# Altium project DRC.PrjPcb (part 1 of 2)
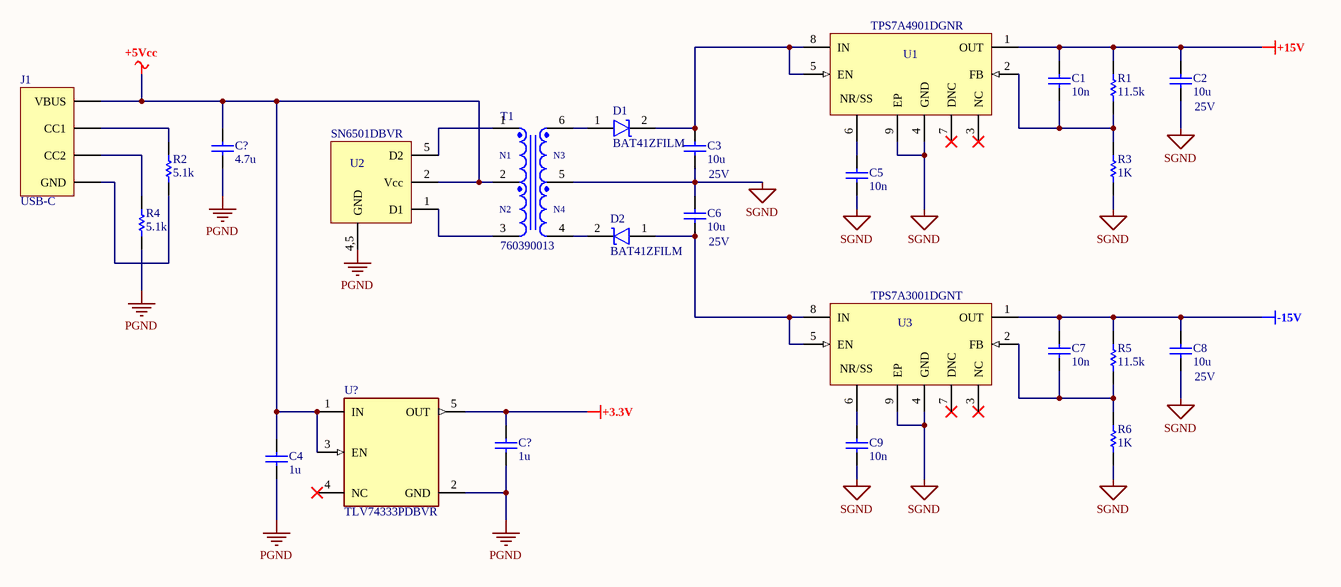
[diagram p0: Power Supply.SchDoc]
15 sheets, 225 parts. Net scope: flat (ports and power ports of the same name join across sheets).
Board file: PCB.PcbDoc
Sheets:
  Power Supply.SchDoc
  MCU.SchDoc
  Balanced Line Receiver.SchDoc
  Precision FBR & dB Converter.SchDoc
  Offset Compensator.SchDoc
  Knee Comp Clipper.SchDoc
  Comp Clipper.SchDoc
  Log and Anti-Log.SchDoc
  Level Detector.SchDoc
  Gain Control.SchDoc
  VCA.SchDoc
  Misc. Connections.SchDoc
  tanh function cell.SchDoc
  Log and Anti-Log Converters 1.SchDoc
  Log and Anti-Log Converters 2.SchDoc

## Sheet Power Supply.SchDoc
size Letter; SheetNumber: 1; SheetTotal: 15; SPICEModelCacheXQHQXUBJ: <root> / <DocumentId>XQHQXUBJ</DocumentId> / </root>

### Parts
(Parts that share a designator on the sheet are numbered #1, #2 ... from top to bottom, then left to right.)
C1  value 10n  (hidden comment: Capacitor)
C2  25V  value 10u
C3  25V  value 10u
C4  value 1u  (hidden comment: Capacitor)
C5  value 10n  (hidden comment: Capacitor)
C6  25V  value 10u
C7  value 10n  (hidden comment: Capacitor)
C8  25V  value 10u
C9  value 10n  (hidden comment: Capacitor)
C?#1  value 4.7u  (hidden comment: Capacitor)
C?#2  value 1u  (hidden comment: Capacitor)
D1  BAT41ZFILM
D2  BAT41ZFILM
J1  USB-C  [FP-USB4125-GF-A-0190-MFG]
R1  value 11.5k  (hidden comment: Resistor)
R2  value 5.1k  (hidden comment: Resistor)
R3  value 1K  (hidden comment: Resistor)
R4  value 5.1k  (hidden comment: Resistor)
R5  value 11.5k  (hidden comment: Resistor)
R6  value 1K  (hidden comment: Resistor)
T1  760390013  [WE-PPTI_1006_L10.2W6.73H4.19]
U1  TPS7A4901DGNR  [DGN0008D_M]
U2  SN6501DBVR
U3  TPS7A3001DGNT  [DGN0008D_M]
U?  TLV74333PDBVR  [FP-DBV0005A-MFG]

### Nets
+3.3V: C?#2.2 U?.5(OUT)
+5Vcc: C4.2 C?#1.2 J1.1(VBUS) T1.2 U2.2(Vcc) U?.1(IN) U?.3(EN)
+15V: C1.2 C2.2 R1.2 U1.1(OUT)
-15V: C7.2 C8.2 R5.2 U3.1(OUT)
PGND: C4.1 C?#1.1 C?#2.1 R4.1 U2.4,5(GND) U?.2(GND)
SGND: C2.1 C3.1 C5.1 C6.2 C8.1 C9.1 R3.1 R6.1 T1.5 U1.4(GND) U1.9(EP) U3.4(GND) U3.9(EP)
NetC1_1: C1.1 R1.1 R3.2 U1.2(FB)
NetC3_2: C3.2 D1.2(K) U1.5(EN) U1.8(IN)
NetC5_2: C5.2 U1.6(NR/SS)
NetC6_1: C6.1 D2.1(A) U3.5(EN) U3.8(IN)
NetC7_1: C7.1 R5.1 R6.2 U3.2(FB)
NetC9_2: C9.2 U3.6(NR/SS)
NetD1_1: D1.1(A) T1.6
NetD2_2: D2.2(K) T1.4
NetJ1_2: J1.2(CC1) R2.2
NetJ1_3: J1.3(CC2) R4.2
NetJ1_4: J1.4(GND) R2.1
NetT1_1: T1.1 U2.5(D2)
NetT1_3: T1.3 U2.1(D1)

Not connected (* = marked no-connect by the designer): U1 3(NC)* 7(DNC)*; U3 3(NC)* 7(DNC)*; U? 4(NC)*

### Notes on the sheet
- (in symbol WE-PPTI_1006) N1; N3; N2; N4

### Library data of the parts
C1-C9 C?#1 C?#2 = Capacitor: SimulationGenericComponent: True
D1 D2 = BAT41ZFILM: Rectifier Diode, Schottky, 1 Phase, 1 Element, 0.2A, 100V V(RRM), Silicon; Manufacturer: STMicroelectronics; Package Body Material: Plastic; Forward Voltage: 450mV; Non-rep Pk Forward Current-Max: 1A; Number of Elements: 1; Max Output current: 200mA; Time @ Peak Reflow Temperature-Max (s): 30s; Qualification Status: Not Qualified; Supplier: Mouser; Supplier Part Number: 511-BAT41ZFILM; Manufacturer Part Number: BAT41ZFILM; RoHS: Yes; Category: Rectifier Diodes; Stock: 43204; Pricing: 1=0.33, 10=0.232, 50=0.232, 100=0.117, 1000=0.071, 10000=0.049 (USD); Pins: 2; Diode Element Material: SILICON; Package Shape: Rectangular; Terminal Finish: Tin; Max Operating Temperature: 150°C; JESD-609 Code: e3; Diode Type: RECTIFIER; JESD-30 Code: R-PDSO-G2; Moisture Sensitivity Level: 1; Package Style: SMALL OUTLINEMeter; Peak Reflow Temperature (Cel): 260°C; Rep Pk Reverse Voltage-Max: 100V; Surface Mount: Yes; Technology: SCHOTTKY; Terminal Form: Gull Wing; Terminal Position: DUAL; Reach SVHC Compliant: Yes; RoHS Compliant: Yes; ComponentLink1URL: https://datasheet.ciiva.com:443/pdfs/VipMasterIC/IC/SGST/SGSTS35734/SGSTS35734-1.pdf?src-supplier=IHS+Markit; ComponentLink1Description: https://datasheet.ciiva.com:443/pdfs/VipMasterIC/IC/SGST/SGSTS35734/SGSTS35734-1.pdf?src-supplier=IHS+Markit; ComponentLink2URL: https://datasheet.ciiva.com/1242/cd00130227-1242625.pdf?src-supplier=Newark; ComponentLink2Description: https://datasheet.ciiva.com/1242/cd00130227-1242625.pdf?src-supplier=Newark; ComponentLink3URL: https://datasheet.ciiva.com/46385/1689714-46385901.pdf?src-supplier=Element14; ComponentLink3Description: https://datasheet.ciiva.com/46385/1689714-46385901.pdf?src-supplier=Element14; ComponentLink4URL: https://datasheet.ciiva.com/46385/1689714-46385899.pdf?src-supplier=Element14; ComponentLink4Description: https://datasheet.ciiva.com/46385/1689714-46385899.pdf?src-supplier=Element14; ComponentLink5URL: https://datasheet.ciiva.com/16421/cd00130227-16421670.pdf?src-supplier=Future+Electronics; ComponentLink5Description: https://datasheet.ciiva.com/16421/cd00130227-16421670.pdf?src-supplier=Future+Electronics; ComponentLink6URL: https://datasheet.ciiva.com/22733/1689714-22733175.pdf?src-supplier=Element14; ComponentLink6Description: https://datasheet.ciiva.com/22733/1689714-22733175.pdf?src-supplier=Element14; ComponentLink7URL: https://datasheet.ciiva.com/915/cd00130227-915684.pdf?src-supplier=Digikey; ComponentLink7Description: https://datasheet.ciiva.com/915/cd00130227-915684.pdf?src-supplier=Digikey; ComponentLink8URL: https://datasheet.ciiva.com/915/cd00130227-915683.pdf?src-supplier=Digikey; ComponentLink8Description: https://datasheet.ciiva.com/915/cd00130227-915683.pdf?src-supplier=Digikey; ComponentLink9URL: https://datasheet.ciiva.com/915/cd00130227-915685.pdf?src-supplier=Digikey; ComponentLink9Description: https://datasheet.ciiva.com/915/cd00130227-915685.pdf?src-supplier=Digikey; ComponentLink10URL: https://datasheet.ciiva.com/15192/getdatasheetpartid-141692-15192973.pdf?src-supplier=Verical; ComponentLink10Description: https://datasheet.ciiva.com/15192/getdatasheetpartid-141692-15192973.pdf?src-supplier=Verical
J1 = USB-C: Generic USB-C Connector, Female
R1-R6 = Resistor: TC1: 0; SimulationGenericComponent: True; TC2: 0
T1 = WE-PPTI_1006: TRANSFORMER 475UH SMD; NexarPartId: 26029731; Turns Ratio: 1:1.7; Current Rating: 150mA; Frequency: 10kHz; DC Resistance (DCR): 470mΩ; Inductance: 475µH; Isolation Voltage: 2.5kV; Termination: SMD/SMT; RoHS: Compliant; Mount: Surface Mount; Length: 10.05mm; Packaging: Digi-Reel®; Height: 4.19mm; Max DC Current: 150mA; Min Operating Temperature: -40°C; Case/Package: SMD/SMT; Max Operating Temperature: 125°C; Height - Seated (Max): 4.19mm; Width: 6.73mm
U1 = TPS7A4901DGNR: Adjustable Positive LDO Regulator, 1.176V Min, 33V Max, 0.6V Dropout, BIPolar, PDSO8; Manufacturer: Texas Instruments; Package Body Material: Plastic; Regulator Type: ADJUSTABLE POSITIVE SINGLE OUTPUT LDO REGULATOR; Dropout Voltage1-Max: 600mV; Dropout Voltage1-Nom: 333mV; Channels: 1; Output Current1-Max: 150mA; Output Voltage1-Min: 1.194V; Package Equivalence Code: TSSOP8,.19; Qualification Status: Not Qualified; Supplier: Mouser; Supplier Part Number: 595-TPS7A4901DGNR; Manufacturer Part Number: TPS7A4901DGNR; RoHS: Yes; Category: Voltage Regulators - Linear; Stock: 5747; Pricing: 1=2.84, 10=2.56, 50=2.56, 100=2.09, 1000=1.5, 10000=1.37 (USD); Case/Package: HTSSOP; Pins: 8; Terminal Finish: Nickel; Package Shape: Square; JESD-609 Code: e4; Moisture Sensitivity Level: 2; Adjustability: ADJUSTABLE; JESD-30 Code: S-PDSO-G8; Number of Outputs: 1; Operating Temperature, TJ-Max: 125°C; Operating Temperature, TJ-Min: -40°C; Output Voltage1-Max: 33V; Package Style: SMALL OUTLINE, HEAT SINK/SLUG, THIN PROFILE, SHRINK PITCHMeter; Packaging: Tape and Reel; Peak Reflow Temperature (Cel): 260°C; Surface Mount: Yes; Technology: BIPOLAR; Terminal Form: Gull Wing; Terminal Position: DUAL; Length: 3mm; Width: 3mm; Height - Seated (Max): 1.1mm; Terminal Pitch: 0.65mm; Reach SVHC Compliant: Yes; RoHS Compliant: Yes; ComponentLink1URL: https://www.ti.com:443/lit/ds/symlink/tps7a49.pdf?src-supplier=IHS+Markit; ComponentLink1Description: https://www.ti.com:443/lit/ds/symlink/tps7a49.pdf?src-supplier=IHS+Markit; ComponentLink2URL: https://datasheet.ciiva.com/4885/sbvs121b-126024-4885345.pdf?src-supplier=Mouser; ComponentLink2Description: https://datasheet.ciiva.com/4885/sbvs121b-126024-4885345.pdf?src-supplier=Mouser; ComponentLink3URL: https://datasheet.ciiva.com/41462/001015155-da-01-en-ic-reg-ldo-adj-tps7a4901dgnr-vssop-8-tid-41462999.pdf?src-supplier=Conrad; ComponentLink3Description: https://datasheet.ciiva.com/41462/001015155-da-01-en-ic-reg-ldo-adj-tps7a4901dgnr-vssop-8-tid-41462999.pdf?src-supplier=Conrad; ComponentLink4URL: https://datasheet.ciiva.com/7547/1857485-7547109.pdf?src-supplier=Newark; ComponentLink4Description: https://datasheet.ciiva.com/7547/1857485-7547109.pdf?src-supplier=Newark; ComponentLink5URL: https://datasheet.ciiva.com/14275/sbvs121b-14275869.pdf?src-supplier=Avnet; ComponentLink5Description: https://datasheet.ciiva.com/14275/sbvs121b-14275869.pdf?src-supplier=Avnet
U2 = SN6501DBVR: Interface Circuit, CMOS, PDSO5; Manufacturer: Texas Instruments; Package Body Material: Plastic; Channels: 1; Package Equivalence Code: TSOP5/6,.11,37; Power Supplies: 3.3/5V; Max Supply Voltage: 5.5V; Min Supply Voltage: 3V; Nominal Supply Voltage: 3.3V; Qualification Status: Not Qualified; Supplier: Mouser; Supplier Part Number: 595-SN6501DBVR; Manufacturer Part Number: SN6501DBVR; RoHS: Yes; Category: Power Management ICs; Stock: 54147; Pricing: 1=2.04, 10=1.8, 50=1.8, 100=1.47, 1000=1.01, 10000=0.88 (USD); Case/Package: LSSOP; Pins: 5; Terminal Finish: Nickel; Package Shape: Rectangular; Min Operating Temperature: -40°C; Max Operating Temperature: 125°C; JESD-609 Code: e4; JESD-30 Code: R-PDSO-G5; Moisture Sensitivity Level: 1; Package Style: SMALL OUTLINE, LOW PROFILE, SHRINK PITCHMeter; Surface Mount: Yes; Terminal Form: Gull Wing; Terminal Position: DUAL; Peak Reflow Temperature (Cel): 260°C; Interface IC Type: INTERFACE CIRCUIT; Technology: CMOS; Length: 2.9mm; Width: 1.6mm; Height - Seated (Max): 1.45mm; Terminal Pitch: 0.95mm; Reach SVHC Compliant: Yes; RoHS Compliant: Yes; Temperature Grade: AUTOMOTIVE; ComponentLink1URL: https://www.ti.com:443/lit/ds/symlink/sn6501.pdf?src-supplier=IHS+Markit; ComponentLink1Description: https://www.ti.com:443/lit/ds/symlink/sn6501.pdf?src-supplier=IHS+Markit; ComponentLink2URL: https://datasheet.ciiva.com/41798/sn6501-41798985.pdf?src-supplier=Digikey; ComponentLink2Description: https://datasheet.ciiva.com/41798/sn6501-41798985.pdf?src-supplier=Digikey
U3 = TPS7A3001DGNT: Adjustable Negative LDO Regulator, 1.18V Min, 33V Max, 0.6V Dropout, BIPolar, PDSO8; Manufacturer: Texas Instruments; Package Body Material: Plastic; Dropout Voltage1-Max: 600mV; Channels: 1; Output Current1-Max: 200mA; Regulator Type: ADJUSTABLE NEGATIVE SINGLE OUTPUT LDO REGULATOR; Dropout Voltage1-Nom: 325mV; Package Equivalence Code: TSSOP8,.19; Qualification Status: Not Qualified; Supplier: Mouser; Supplier Part Number: 595-TPS7A3001DGNT; Manufacturer Part Number: TPS7A3001DGNT; RoHS: Yes; Category: Voltage Regulators - Linear; Stock: 15878; Pricing: 1=4.76, 10=4.19, 50=4.19, 100=3.5, 250=3.32, 500=2.98, 1000=2.52, 2500=2.39, 10000=2.39 (USD); Case/Package: HTSSOP; Pins: 8; Package Shape: Square; Terminal Finish: Nickel; JESD-609 Code: e4; JESD-30 Code: S-PDSO-G8; Moisture Sensitivity Level: 2; Operating Temperature, TJ-Max: 125°C; Operating Temperature, TJ-Min: -40°C; Output Voltage1-Max: 33V; Output Voltage1-Min: 1.18V; Package Style: SMALL OUTLINE, HEAT SINK/SLUG, THIN PROFILE, SHRINK PITCHMeter; Surface Mount: Yes; Technology: BIPOLAR; Terminal Form: Gull Wing; Terminal Position: DUAL; Adjustability: ADJUSTABLE; Number of Outputs: 1; Packaging: Tape and Reel; Peak Reflow Temperature (Cel): 260°C; Length: 3mm; Width: 3mm; Height - Seated (Max): 1.1mm; Terminal Pitch: 0.65mm; Reach SVHC Compliant: Yes; RoHS Compliant: Yes; ComponentLink1URL: https://www.ti.com:443/lit/ds/symlink/tps7a30.pdf?src-supplier=IHS+Markit; ComponentLink1Description: https://www.ti.com:443/lit/ds/symlink/tps7a30.pdf?src-supplier=IHS+Markit; ComponentLink2URL: https://datasheet.ciiva.com/22733/1726442-22733400.pdf?src-supplier=Farnell; ComponentLink2Description: https://datasheet.ciiva.com/22733/1726442-22733400.pdf?src-supplier=Farnell; ComponentLink3URL: https://datasheet.ciiva.com/4885/sbvs125a-126025-4885255.pdf?src-supplier=Mouser; ComponentLink3Description: https://datasheet.ciiva.com/4885/sbvs125a-126025-4885255.pdf?src-supplier=Mouser; ComponentLink4URL: https://datasheet.ciiva.com/14276/tps7a3001-14276192.pdf?src-supplier=Avnet; ComponentLink4Description: https://datasheet.ciiva.com/14276/tps7a3001-14276192.pdf?src-supplier=Avnet
U? = CMP-04917-000051-1: IC REG LINEAR 3.3V 300MA SOT23-5; Manufacturer: Texas Instruments; Dropout Voltage: 125mV; Output Type: Fixed; Min Supply Voltage: 1.4V; Max Supply Voltage: 5.5V; Output Voltage: 1-3.3V; Standoff Height: 0mm; Nominal Supply Current: 34uA; Number Of Outputs: 1; Accuracy Percentage: 1%; Max Junction Temp: +125°C; Mouser Description: 300mA Low-Dropout (LDO) Regulator 5-SOT-23 -40 to 125; Device Class L1: Integrated Circuits (ICs); Temperature Range High: +125°C; Octopart: https://octopart.com/tlv74333pdbvr-texas+instruments-84791760; Device Class L3: Voltage Regulators - Linear; Height: 1.45mm; Category: IC; Temperature Range Low: -40°C; Output Current: 300mA; RoHS: TRUE; Automotive: No; Manufacturer Part Number: TLV74333PDBVR; Digikey Description: IC REG LINEAR 3.3V 300MA SOT23-5; Package: DBV0005A; Temperature: -40°C to +125°C; ComponentLink2URL: http://www.ti.com/lit/ds/symlink/tlv743p.pdf; Lead Free: Yes; Device Class L2: Power Management ICs; ComponentLink2Description: Datasheet

## Sheet MCU.SchDoc
size A; SheetNumber: 2; SheetTotal: 15
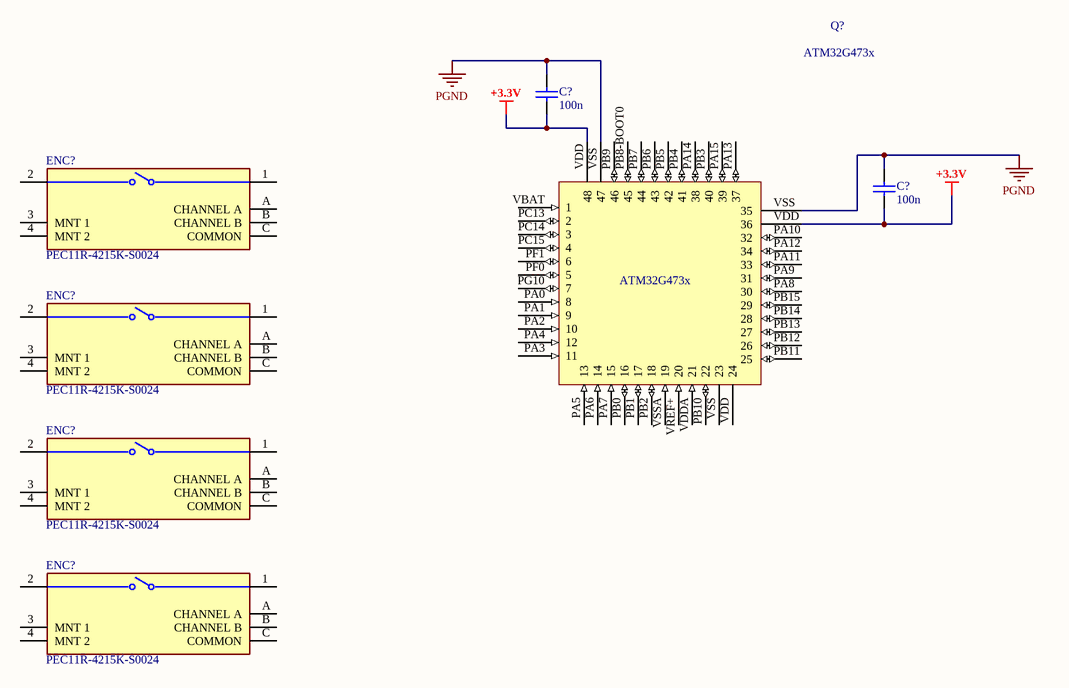
[diagram p1: MCU.SchDoc]

### Parts
(Parts that share a designator on the sheet are numbered #1, #2 ... from top to bottom, then left to right.)
C?#3  value 100n  (hidden comment: Capacitor)
C?#4  value 100n  (hidden comment: Capacitor)
ENC?#1  PEC11R-4215K-S0024  [FP-PEC11R-4215K-S0024-MFG]
ENC?#2  PEC11R-4215K-S0024  [FP-PEC11R-4215K-S0024-MFG]
ENC?#3  PEC11R-4215K-S0024  [FP-PEC11R-4215K-S0024-MFG]
ENC?#4  PEC11R-4215K-S0024  [FP-PEC11R-4215K-S0024-MFG]
Q?  ATM32G473x  [CQFP50P900X900X160-48N]

### Nets
+3.3V: C?#3.1 C?#4.1 Q?.VDD(24)
PGND: C?#3.2 C?#4.2 Q?.VSS(23)

Not connected (* = marked no-connect by the designer): ENC?#1 1 2 3(MNT_1) 4(MNT_2) A(CHANNEL_A) B(CHANNEL_B) C(COMMON); ENC?#2 1 2 3(MNT_1) 4(MNT_2) A(CHANNEL_A) B(CHANNEL_B) C(COMMON); ENC?#3 1 2 3(MNT_1) 4(MNT_2) A(CHANNEL_A) B(CHANNEL_B) C(COMMON); ENC?#4 1 2 3(MNT_1) 4(MNT_2) A(CHANNEL_A) B(CHANNEL_B) C(COMMON); Q? PA0(8) PA1(9) PA2(10) PA3(11) PA4(12) PA5(13) PA6(14) PA7(15) PA8(30) PA9(31) PA10(32) PA11(33) PA12(34) PA13(37) PA14(38) PA15(39) PB0(16) PB1(17) PB2(18) PB3(40) PB4(41) PB5(42) PB6(43) PB7(44) PB8-BOOT0(45) PB9(46) PB10(22) PB11(25) PB12(26) PB13(27) PB14(28) PB15(29) PC13(2) PC14(3) PC15(4) PF0(5) PF1(6) PG10(7) VBAT(1) VDDA(21) VREF+(20) VSSA(19)

### Library data of the parts
C?#3 C?#4 = Capacitor: SimulationGenericComponent: True
ENC?#1-ENC?#4 = CMP-07421-000020-1: ROTARY ENCODER MECHANICAL 24PPR; Built in Switch: Yes; Output Type: Quadrature; Pulses per Revolution: 24; Number of Channels: 2; Max Supply Voltage (DC): 5V; Hole Diameter: 1.8mm; Packaging: Bulk; Series: PEC11R; REACH SVHC: No SVHC; Mount: Through Hole; RoHS Compliant: Yes; Length: 21.5mm; Termination: PC Pin; Width: 12.5mm; Min Operating Temperature: -30°C; Package Quantity: 150; Orientation: Vertical; Encoder Type: Mechanical; Height: 13.4mm; Detent: Yes; Max Operating Temperature: 70°C
Q? = ATM32G473x: Arm® Cortex®-M4 32-bit MCU+FPU, up to 512 KB Flash, 170 MHz / / 213DMIPS, 128 KB SRAM

## Sheet Balanced Line Receiver.SchDoc
size Letter; SheetNumber: 2; SheetTotal: 14
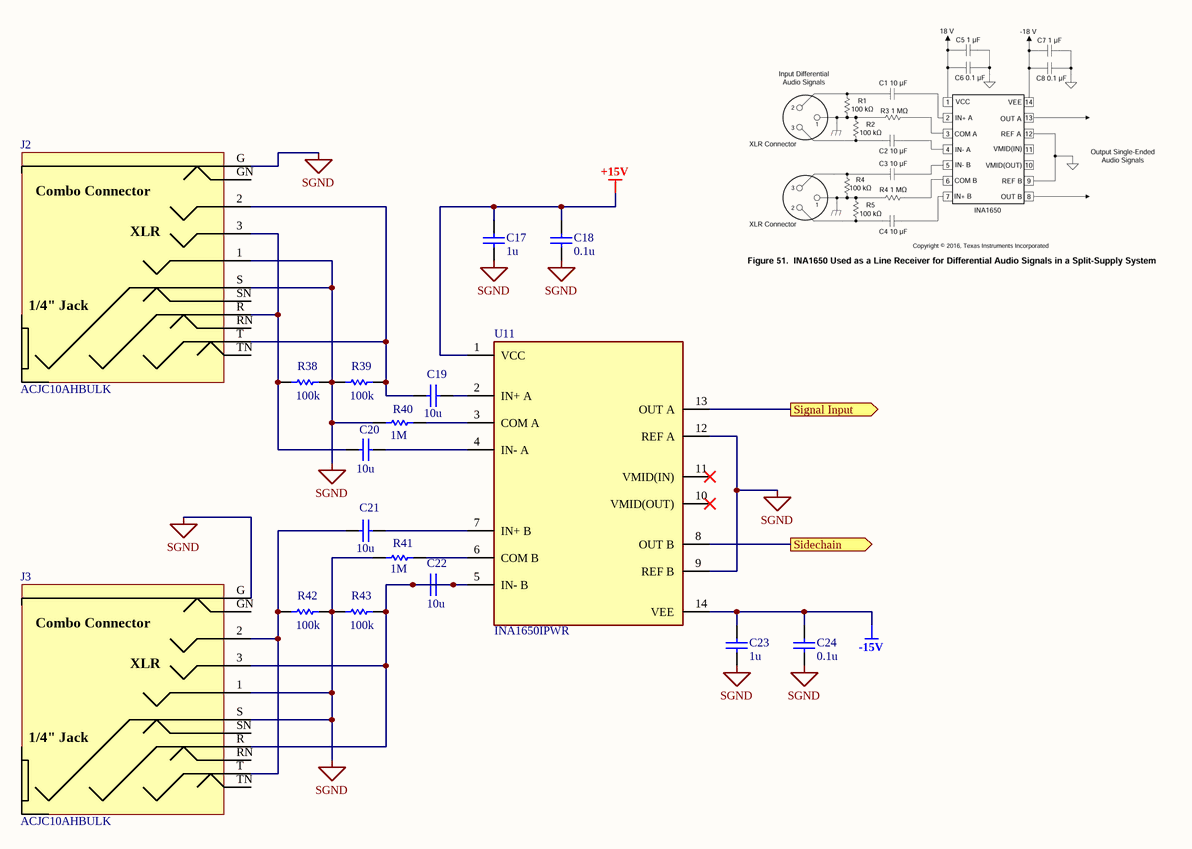
[diagram p2: Balanced Line Receiver.SchDoc]

### Parts
C17  value 1u  (hidden comment: Capacitor)
C18  value 0.1u  (hidden comment: Capacitor)
C19  value 10u  (hidden comment: Capacitor)
C20  value 10u  (hidden comment: Capacitor)
C21  value 10u  (hidden comment: Capacitor)
C22  value 10u  (hidden comment: Capacitor)
C23  value 1u  (hidden comment: Capacitor)
C24  value 0.1u  (hidden comment: Capacitor)
J2  ACJC10AHBULK  [ACJC10AH]
J3  ACJC10AHBULK  [ACJC10AH]
R38  value 100k  (hidden comment: Resistor)
R39  value 100k  (hidden comment: Resistor)
R40  value 1M  (hidden comment: Resistor)
R41  value 1M  (hidden comment: Resistor)
R42  value 100k  (hidden comment: Resistor)
R43  value 100k  (hidden comment: Resistor)
U11  INA1650IPWR  [FP-PW0014A-IPC_C]

### Ports
Sidechain (out), Signal Input (out)

### Nets
+15V: C17.2 C18.2 U11.1(VCC)
-15V: C23.2 C24.2 U11.14(VEE)
SGND: C17.1 C18.1 C23.1 C24.1 J2.1 J2.G J2.S J3.1 J3.G J3.S R38.1 R39.2 R40.2 R41.2 R42.1 R43.2 U11.9(REF_B) U11.12(REF_A)
NetC19_1: C19.1 U11.2(IN+_A)
NetC19_2: C19.2 J2.2 J2.T R39.1
NetC20_1: C20.1 U11.4(IN-_A)
NetC20_2: C20.2 J2.3 J2.R R38.2
NetC21_1: C21.1 U11.7(IN+_B)
NetC21_2: C21.2 J3.2 J3.T R42.2
NetC22_1: C22.1 C22.2 J3.3 J3.R R43.1 U11.5(IN-_B)
NetR40_1: R40.1 U11.3(COM_A)
NetR41_1: R41.1 U11.6(COM_B)
NetU11_8: U11.8(OUT_B) ; port Sidechain
NetU11_13: U11.13(OUT_A) ; port Signal Input

Not connected (* = marked no-connect by the designer): J2 GN RN SN TN; J3 GN RN SN TN; U11 10(VMID(OUT))* 11(VMID(IN))*

### Notes on the sheet
- (in symbol ACJC10AHBULK) Combo Connector; XLR; 1/4" Jack

### Library data of the parts
C17-C24 = Capacitor: SimulationGenericComponent: True
J2 J3 = ACJC10AHBULK: Audio/RCA Connector, 10 Pole(s), Female, Solder Terminal, Latch, Receptacle; Manufacturer: Amphenol; Supplier: Digikey; Supplier Part Number: 889-ACJC10AHBULK-ND; Manufacturer Part Number: ACJC10AHBULK; RoHS: Yes; Stock: 1003; Pricing: 1=3.96, 10=3.6, 25=3.4092, 50=3.33, 100=3.1714, 250=2.77496, 500=2.69568, 1000=2.29926, 2500=2.1407 (USD); Contact Finish - Mating: NOT SPECIFIED; Connector Type: AUDIO/RCA CONNECTOR; RoHS Compliant: Yes; ComponentLink1URL: https://datasheet.ciiva.com:443/pdfs/VipMasterIC/IC/AMPH/AMPHS14349/AMPHS14349-1.pdf?src-supplier=IHS+Markit; ComponentLink1Description: https://datasheet.ciiva.com:443/pdfs/VipMasterIC/IC/AMPH/AMPHS14349/AMPHS14349-1.pdf?src-supplier=IHS+Markit; ComponentLink2URL: https://datasheet.ciiva.com/15309/88010807000-acjc10ah-241575-15309467.pdf?src-supplier=Mouser; ComponentLink2Description: https://datasheet.ciiva.com/15309/88010807000-acjc10ah-241575-15309467.pdf?src-supplier=Mouser
R38-R43 = Resistor: TC1: 0; SimulationGenericComponent: True; TC2: 0
U11 = INA1650IPWR: IC AUDIO RECEIVER 14TSSOP; Number of Channels: 2; RoHS Compliant: Yes; Packaging: Tape and Reel; Number of Pins: 14; Min Operating Temperature: -40°C; Case/Package: TSSOP; Logic Function: Receiver; Max Operating Temperature: 125°C

## Sheet Precision FBR & dB Converter.SchDoc
size Letter; SheetNumber: 3; SheetTotal: 14
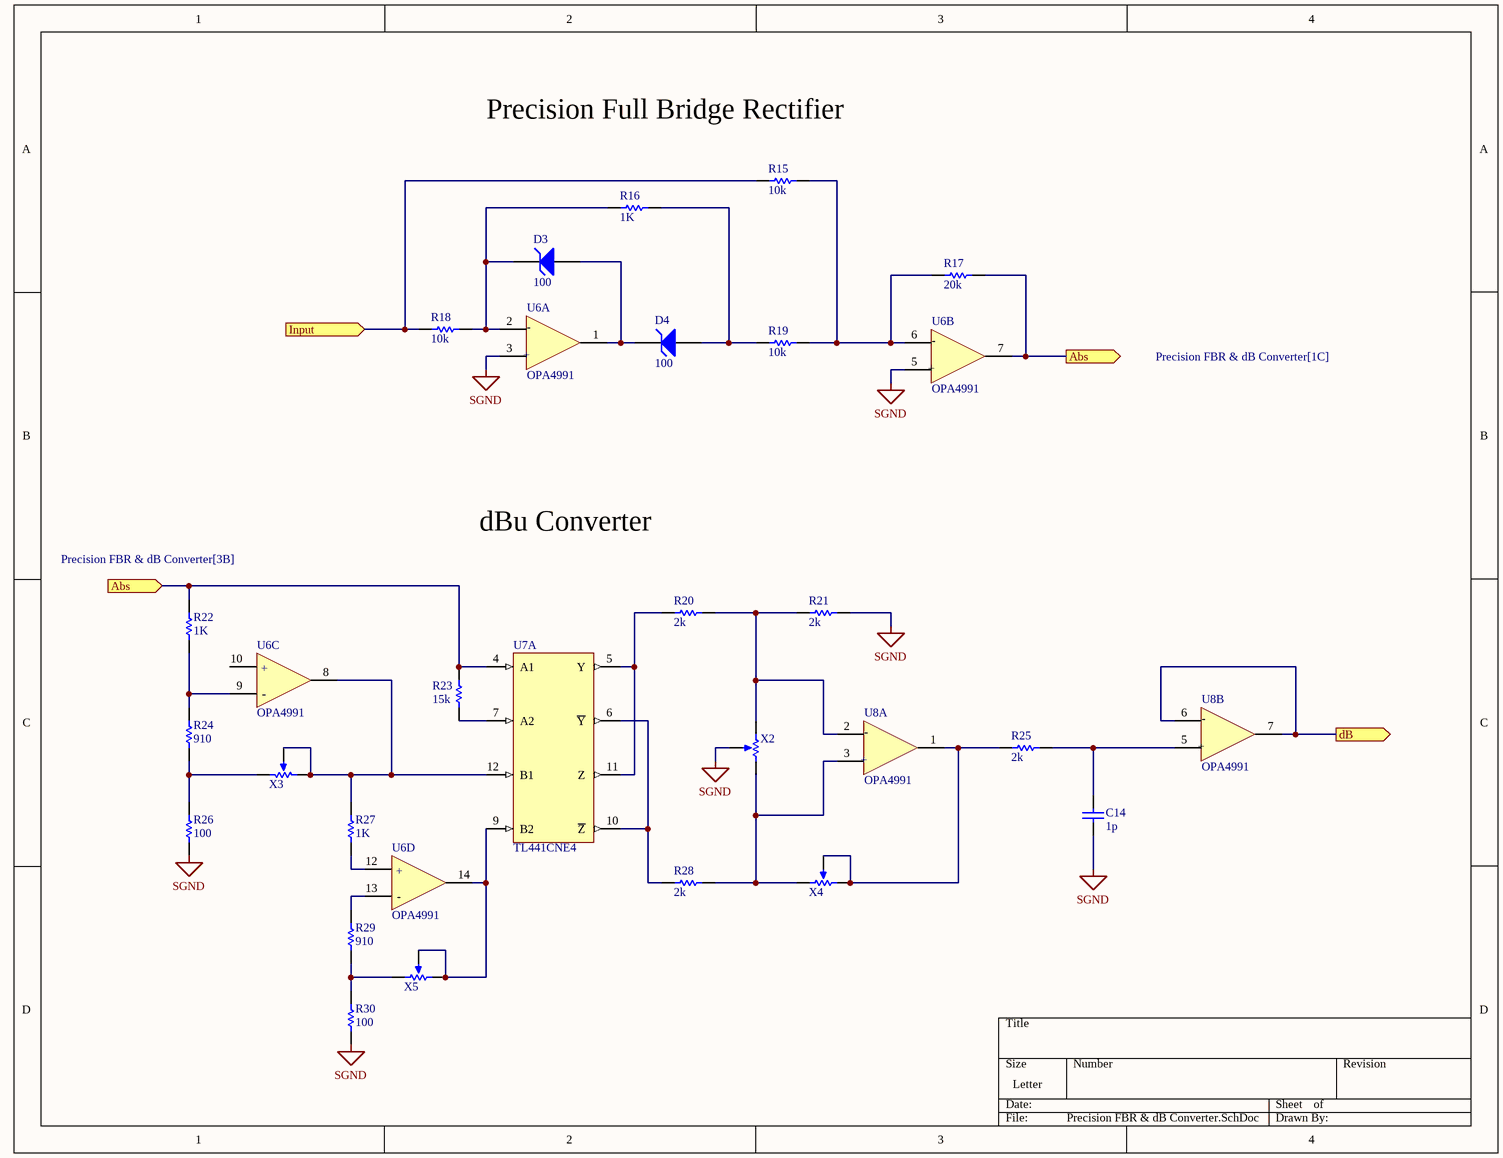
[diagram p3: Precision FBR & dB Converter.SchDoc]

### Parts
(Parts that share a designator on the sheet are numbered #1, #2 ... from top to bottom, then left to right.)
C14  value 1p  (hidden comment: Capacitor)
D3  BV: 100  (hidden comment: Zener Diode)
D4  BV: 100  (hidden comment: Zener Diode)
R15  value 10k  (hidden comment: Resistor)
R16  value 1K  (hidden comment: Resistor)
R17  value 20k  (hidden comment: Resistor)
R18  value 10k  (hidden comment: Resistor)
R19  value 10k  (hidden comment: Resistor)
R20  value 2k  (hidden comment: Resistor)
R21  value 2k  (hidden comment: Resistor)
R22  value 1K  (hidden comment: Resistor)
R23  value 15k  (hidden comment: Resistor)
R24  value 910  (hidden comment: Resistor)
R25  value 2k  (hidden comment: Resistor)
R26  value 100  (hidden comment: Resistor)
R27  value 1K  (hidden comment: Resistor)
R28  value 2k  (hidden comment: Resistor)
R29  value 910  (hidden comment: Resistor)
R30  value 100  (hidden comment: Resistor)
U6  OPA4991  [FP-D0014A-IPC_B]  (parts A,B,C,D of 5)
U7  TL441CNE4  [TI-N16]  (part A of 3)
U8#1  OPA4991  [FP-D0014A-IPC_B]  (parts A,B of 5)
X2  Potentiometer  (value not drawn)
X3  Potentiometer  (value not drawn)
X4  Potentiometer  (value not drawn)
X5  Potentiometer  (value not drawn)

### Ports
Abs (in, see Precision FBR & dB Converter[3B]), Abs (out, see Precision FBR & dB Converter[1C]), dB (out), Input (in)

### Nets
SGND: C14.1 R21.2 R26.1 R30.1 U6.3(IN1+) U6.5(IN2+) X2.3(TAP)
NetC14_2: C14.2 R25.2 U8#1.5(IN2+)
NetD3_1: D3.1(A) D4.2(K) U6.1(OUT1)
NetD3_2: D3.2(K) R16.1 R18.2 U6.2(IN1-)
NetD4_1: D4.1(A) R16.2 R19.1
NetR15_1: R15.1 R18.1 ; port Input
NetR15_2: R15.2 R17.1 R19.2 U6.6(IN2-)
NetR17_2: R17.2 R22.2 R23.1 U6.7(OUT2) U7.4(A1) ; port Abs
NetR20_1: R20.1 U7.5(Y) U7.11(Z)
NetR20_2: R20.2 R21.1 U8#1.2(IN1-) X2.1(TOP)
NetR22_1: R22.1 R24.2 U6.9(IN3-)
NetR23_2: R23.2 U7.7(A2)
NetR24_1: R24.1 R26.2 X3.1(TOP)
NetR25_1: R25.1 U8#1.1(OUT1) X4.1(TOP) X4.3(TAP)
NetR27_1: R27.1 U6.12(IN4+)
NetR27_2: R27.2 U6.8(OUT3) U7.12(B1) X3.2(BOT) X3.3(TAP)
NetR28_1: R28.1 U7.6(~{Y}) U7.10(~{Z})
NetR28_2: R28.2 U8#1.3(IN1+) X2.2(BOT) X4.2(BOT)
NetR29_1: R29.1 R30.2 X5.2(BOT)
NetR29_2: R29.2 U6.13(IN4-)
NetU6_14: U6.14(OUT4) U7.9(B2) X5.1(TOP) X5.3(TAP)
NetU8#1_6: U8#1.6(IN2-) U8#1.7(OUT2) ; port dB

Not connected (* = marked no-connect by the designer): U6 10(IN3+)

### Notes on the sheet
- Precision Full Bridge Rectifier
- dBu Converter
- (in symbol OPA4991IDR, part A) -; +
- (in symbol OPA4991IDR, part B) -; +
- (in symbol OPA4991IDR, part C) +; -
- (in symbol OPA4991IDR, part D) +; -

### Library data of the parts
C14 = Capacitor: SimulationGenericComponent: True
D3 D4 = Zener Diode: AF: 1; BV_MAX: 1e99; CJO: 0; EG: 1.11; FC: 0.5; IBV: 0.001; IS: 1e-14; MJSW: 0.33; NTUN: 30; TNOM: 27; XTI: 3; SimulationGenericComponent: True; CJP: 0; CTA: 0; CTP: 0; FCS: 0.5; FV_MAX: 1e99; IKF: 0; IKR: 0; ISR: 1e-14; JSW: 0; JTUN: 0; JTUNSW: 0; KEG: 1; KF: 0; LEVEL: 1; N: 1; NBV: 1; NR: 1; NS: 1; PHP: 1; RS: 0; TCV: 0; TLEV: 0; TLEVC: 0; TM1: 0; TM2: 0; TPB: 0; TPHP: 0; TRS: 0; TRS2: 0; TT: 0; TTT1: 0; TTT2: 0; VJ: 1; XTITUN: 3
R15-R30 = Resistor: TC1: 0; SimulationGenericComponent: True; TC2: 0
U6 U8#1 = OPA4991IDR: 40-V, DUAL 4.5MHZ, RAIL-TO-RAIL
U7 = TL441CNE4: Logarithmic Amplifier, 0 to 70 degC, 16-pin DIP (N16), Pb-Free (RoHS); Manufacturer: Texas Instruments; Iq(Max)(mA): 23; DatasheetVersion: SLVS328; ComponentLink3URL: http://www.ti.com/litv/pdf/mpdi002c; Eco-Plan: Pb-Free (RoHS); ComponentLink2URL: http://www.ti.com/general/docs/lit/getliterature.tsp?genericPartNumber=TL441&fileType=pdf; SubFamily: Logarithmic Amplifier; ComponentLink3Description: Package Specification; ComponentLink1Description: Manufacturer URL; ComponentLink1URL: http://www.ti.com/; PackageDescription: 16-Pin Plastic In-Line, Body 19.305 x 6.35 mm, Pitch 2.54 mm; PackageVersion: 4040049/E, 12/2002; Code_JEDEC: MS-001; PartNumber: TL441CNE4; ComponentLink2Description: Datasheet; PackageReference: N16; Mounting Technology: Through Hole
X2-X5 = Potentiometer: value: 1k; position: 0.5; SimulationGenericComponent: True

## Sheet Offset Compensator.SchDoc
size Letter; SheetNumber: 4; SheetTotal: 14
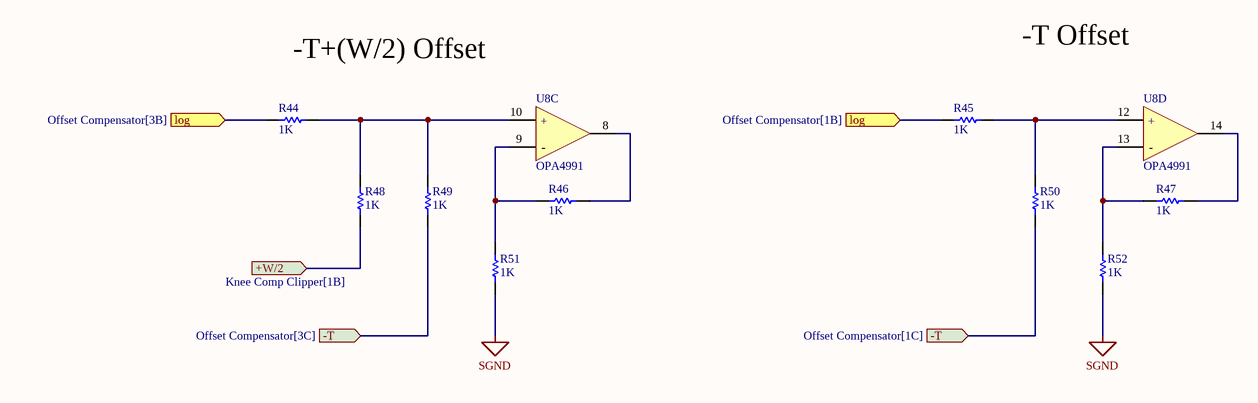
[diagram p4: Offset Compensator.SchDoc]

### Parts
(Parts that share a designator on the sheet are numbered #1, #2 ... from top to bottom, then left to right.)
R44  value 1K  (hidden comment: Resistor)
R45  value 1K  (hidden comment: Resistor)
R46  value 1K  (hidden comment: Resistor)
R47  value 1K  (hidden comment: Resistor)
R48  value 1K  (hidden comment: Resistor)
R49  value 1K  (hidden comment: Resistor)
R50  value 1K  (hidden comment: Resistor)
R51  value 1K  (hidden comment: Resistor)
R52  value 1K  (hidden comment: Resistor)
U8#1  OPA4991  [FP-D0014A-IPC_B]  (parts C,D of 5)

### Ports
+W/2 (in, see Knee Comp Clipper[1B]), -T (in, see Offset Compensator[1C]), -T (in, see Offset Compensator[3C]), log (in, see Offset Compensator[1B]), log (in, see Offset Compensator[3B])

### Nets
SGND: R51.2 R52.2
NetR44_1: R44.1 R45.1 ; port log
NetR44_2: R44.2 R48.2 R49.2 U8#1.10(IN3+)
NetR45_2: R45.2 R50.2 U8#1.12(IN4+)
NetR46_1: R46.1 U8#1.8(OUT3)
NetR46_2: R46.2 R51.1 U8#1.9(IN3-)
NetR47_1: R47.1 U8#1.14(OUT4)
NetR47_2: R47.2 R52.1 U8#1.13(IN4-)
NetR48_1: R48.1 ; port +W/2
NetR49_1: R49.1 R50.1 ; port -T

### Notes on the sheet
- -T+(W/2) Offset
- -T Offset
- (in symbol OPA4991IDR, part C) +; -
- (in symbol OPA4991IDR, part D) +; -

### Library data of the parts
R44-R52 = Resistor: TC1: 0; SimulationGenericComponent: True; TC2: 0
U8#1 = OPA4991IDR: 40-V, DUAL 4.5MHZ, RAIL-TO-RAIL

## Sheet Knee Comp Clipper.SchDoc
size Letter; SheetNumber: 6; SheetTotal: 14
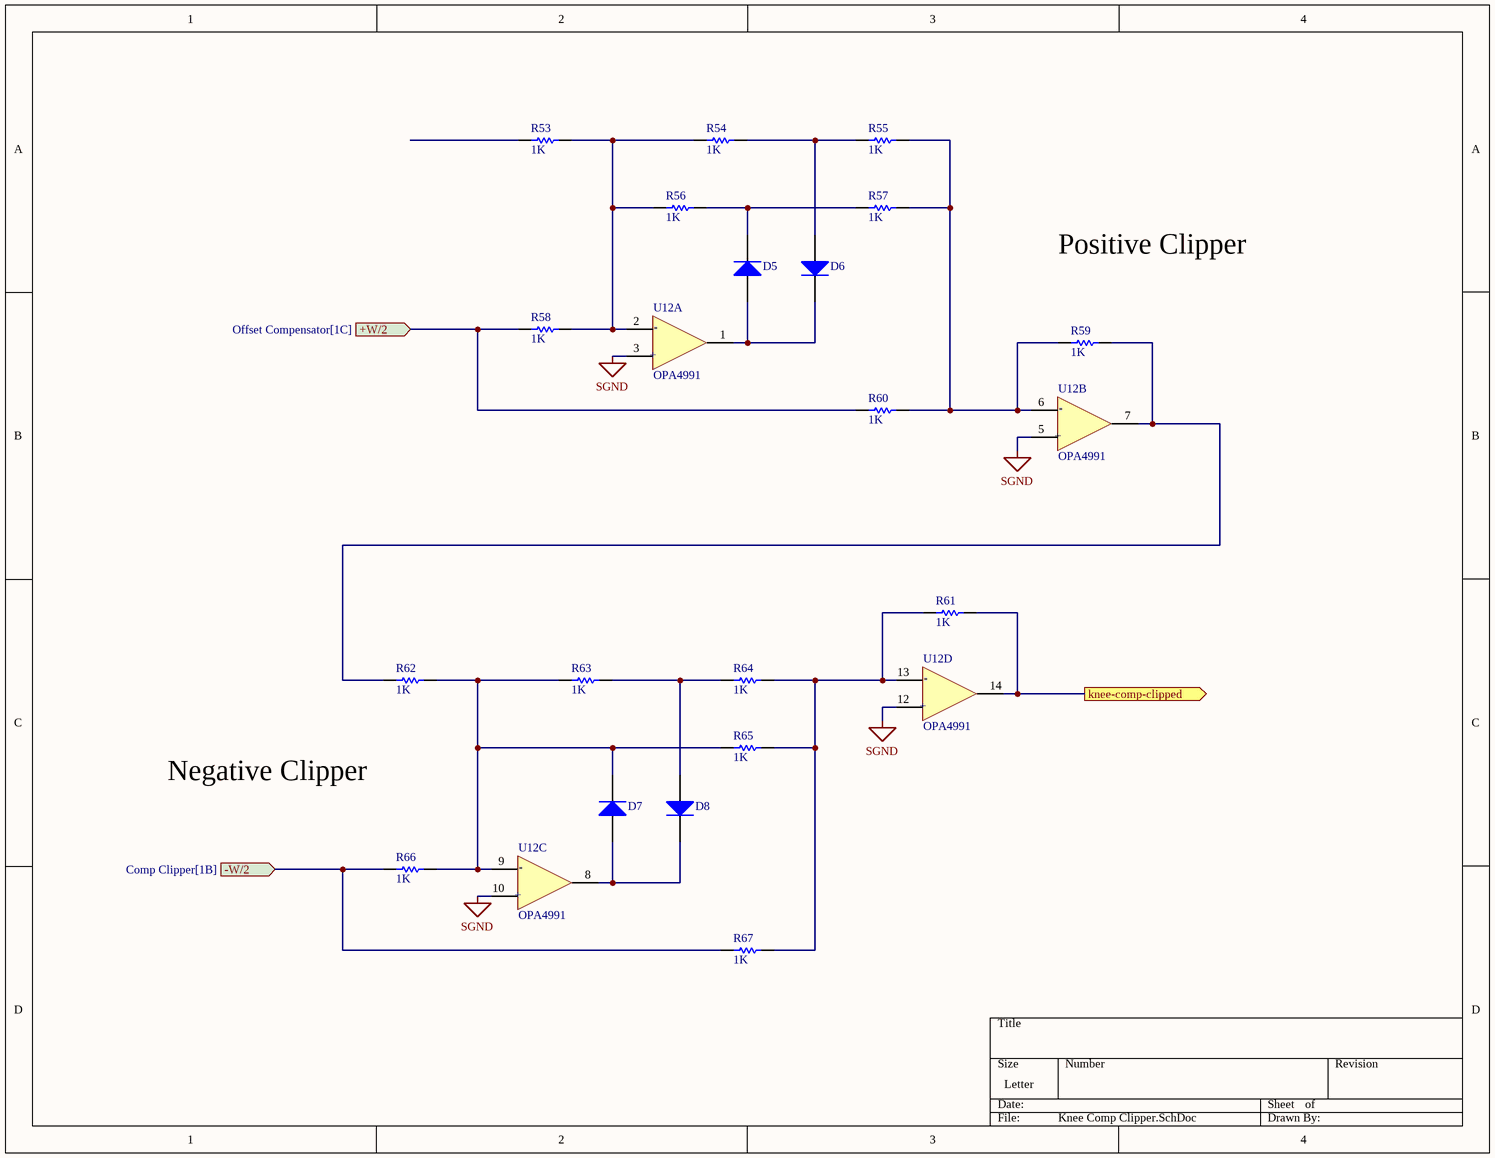
[diagram p5: Knee Comp Clipper.SchDoc]

### Parts
D5  Diode  (value not drawn)
D6  Diode  (value not drawn)
D7  Diode  (value not drawn)
D8  Diode  (value not drawn)
R53  value 1K  (hidden comment: Resistor)
R54  value 1K  (hidden comment: Resistor)
R55  value 1K  (hidden comment: Resistor)
R56  value 1K  (hidden comment: Resistor)
R57  value 1K  (hidden comment: Resistor)
R58  value 1K  (hidden comment: Resistor)
R59  value 1K  (hidden comment: Resistor)
R60  value 1K  (hidden comment: Resistor)
R61  value 1K  (hidden comment: Resistor)
R62  value 1K  (hidden comment: Resistor)
R63  value 1K  (hidden comment: Resistor)
R64  value 1K  (hidden comment: Resistor)
R65  value 1K  (hidden comment: Resistor)
R66  value 1K  (hidden comment: Resistor)
R67  value 1K  (hidden comment: Resistor)
U12  OPA4991  [FP-D0014A-IPC_B]  (parts A,B,C,D of 5)

### Ports
+W/2 (in, see Offset Compensator[1C]), -W/2 (in, see Comp Clipper[1B]), knee-comp-clipped (out)

### Nets
SGND: U12.3(IN1+) U12.5(IN2+) U12.10(IN3+) U12.12(IN4+)
NetD5_1: D5.1(A) D6.2(K) U12.1(OUT1)
NetD5_2: D5.2(K) R56.2 R57.1
NetD6_1: D6.1(A) R54.2 R55.1
NetD7_1: D7.1(A) D8.2(K) U12.8(OUT3)
NetD7_2: D7.2(K) R62.2 R63.1 R65.1 R66.2 U12.9(IN3-)
NetD8_1: D8.1(A) R63.2 R64.1
NetR48_1: R58.1 R60.1 ; port +W/2
NetR53_2: R53.2 R54.1 R56.1 R58.2 U12.2(IN1-)
NetR55_2: R55.2 R57.2 R59.1 R60.2 U12.6(IN2-)
NetR59_2: R59.2 R62.1 U12.7(OUT2)
NetR61_1: R61.1 R64.2 R65.2 R67.2 U12.13(IN4-)
NetR61_2: R61.2 U12.14(OUT4) ; port knee-comp-clipped
NetR66_1: R66.1 R67.1 ; port -W/2

Not connected (* = marked no-connect by the designer): R53 1

### Notes on the sheet
- Positive Clipper
- Negative Clipper
- (in symbol OPA4991IDR, part A) -; +
- (in symbol OPA4991IDR, part B) -; +
- (in symbol OPA4991IDR, part C) -; +
- (in symbol OPA4991IDR, part D) -; +

### Library data of the parts
D5-D8 = Diode: AF: 1; BV: 0; BV_MAX: 1e99; EG: 1.11; FC: 0.5; IBV: 0.001; ISR: 1e-14; MJSW: 0.33; NTUN: 30; TNOM: 27; XTI: 3; SimulationGenericComponent: True; CJO: 0; CJP: 0; CTA: 0; CTP: 0; FCS: 0.5; FV_MAX: 1e99; IKF: 0; IKR: 0; JSW: 0; JTUN: 0; JTUNSW: 0; KEG: 1; KF: 0; LEVEL: 1; N: 1; NBV: 1; NR: 1; NS: 1; PHP: 1; RS: 0; TCV: 0; TLEV: 0; TLEVC: 0; TM1: 0; TM2: 0; TPB: 0; TPHP: 0; TRS: 0; TRS2: 0; TT: 0; TTT1: 0; TTT2: 0; VJ: 1; XTITUN: 3; IS: 1e-14
R53-R67 = Resistor: TC1: 0; SimulationGenericComponent: True; TC2: 0
U12 = OPA4991IDR: 40-V, DUAL 4.5MHZ, RAIL-TO-RAIL

## Sheet Comp Clipper.SchDoc
size Letter; SheetNumber: 5; SheetTotal: 14
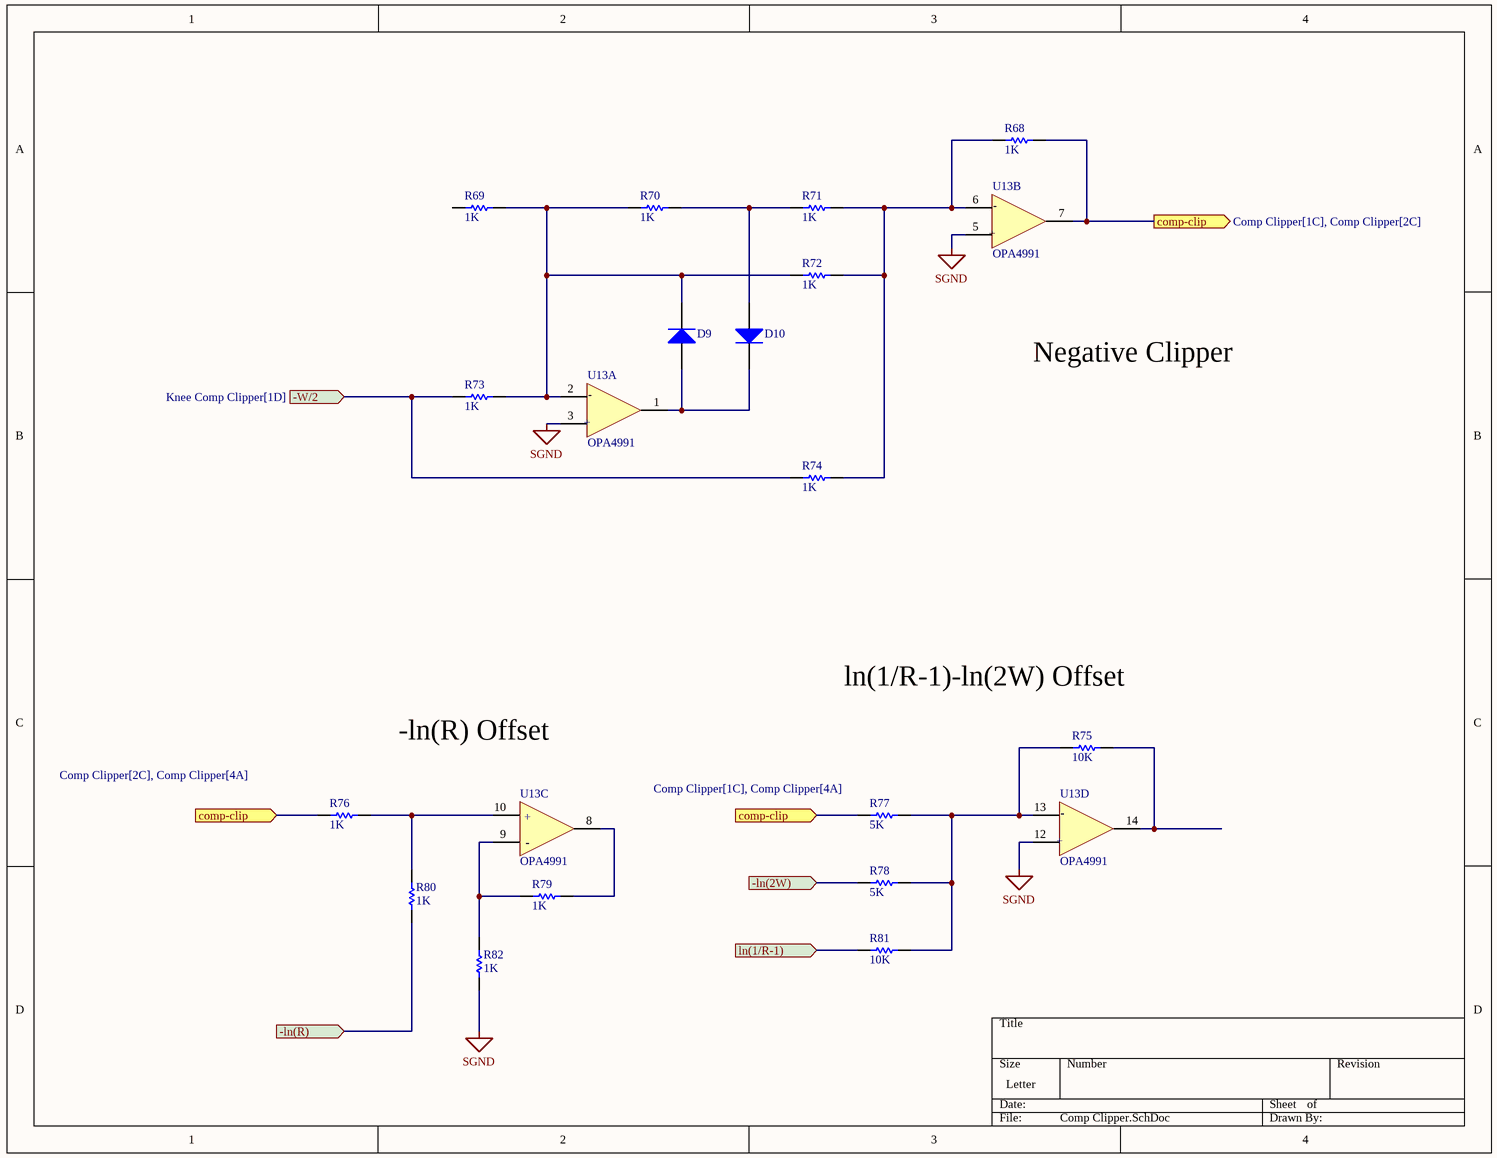
[diagram p6: Comp Clipper.SchDoc]

### Parts
D9  Diode  (value not drawn)
D10  Diode  (value not drawn)
R68  value 1K  (hidden comment: Resistor)
R69  value 1K  (hidden comment: Resistor)
R70  value 1K  (hidden comment: Resistor)
R71  value 1K  (hidden comment: Resistor)
R72  value 1K  (hidden comment: Resistor)
R73  value 1K  (hidden comment: Resistor)
R74  value 1K  (hidden comment: Resistor)
R75  value 10K  (hidden comment: Resistor)
R76  value 1K  (hidden comment: Resistor)
R77  value 5K  (hidden comment: Resistor)
R78  value 5K  (hidden comment: Resistor)
R79  value 1K  (hidden comment: Resistor)
R80  value 1K  (hidden comment: Resistor)
R81  value 10K  (hidden comment: Resistor)
R82  value 1K  (hidden comment: Resistor)
U13  OPA4991  [FP-D0014A-IPC_B]  (parts A,B,C,D of 5)

### Ports
-ln(2W) (in), -ln(R) (in), -W/2 (in, see Knee Comp Clipper[1D]), comp-clip (in, see Comp Clipper[1C], Comp Clipper[4A]), comp-clip (in, see Comp Clipper[2C], Comp Clipper[4A]), comp-clip (out, see Comp Clipper[1C], Comp Clipper[2C]), ln(1/R-1) (in)

### Nets
SGND: R82.2 U13.3(IN1+) U13.5(IN2+) U13.12(IN4+)
NetD9_1: D9.1(A) D10.2(K) U13.1(OUT1)
NetD9_2: D9.2(K) R69.2 R70.1 R72.1 R73.2 U13.2(IN1-)
NetD10_1: D10.1(A) R70.2 R71.1
NetR66_1: R73.1 R74.1 ; port -W/2
NetR68_1: R68.1 R71.2 R72.2 R74.2 U13.6(IN2-)
NetR68_2: R68.2 R76.1 R77.1 U13.7(OUT2) ; port comp-clip
NetR75_1: R75.1 U13.14(OUT4)
NetR75_2: R75.2 R77.2 R78.1 R81.2 U13.13(IN4-)
NetR76_2: R76.2 R80.2 U13.10(IN3+)
NetR78_2: R78.2 ; port -ln(2W)
NetR79_1: R79.1 U13.8(OUT3)
NetR79_2: R79.2 R82.1 U13.9(IN3-)
NetR80_1: R80.1 ; port -ln(R)
NetR81_1: R81.1 ; port ln(1/R-1)

Not connected (* = marked no-connect by the designer): R69 1

### Notes on the sheet
- Negative Clipper
- ln(1/R-1)-ln(2W) Offset
- -ln(R) Offset
- (in symbol OPA4991IDR, part A) -; +
- (in symbol OPA4991IDR, part B) -; +
- (in symbol OPA4991IDR, part C) +; -
- (in symbol OPA4991IDR, part D) -; +

### Library data of the parts
D9 D10 = Diode: as D5 on sheet Knee Comp Clipper; CJO: 0; CJP: 0; CTA: 0; CTP: 0; FCS: 0.5; FV_MAX: 1e99; IKF: 0; IKR: 0; JSW: 0; JTUN: 0; JTUNSW: 0; KEG: 1; KF: 0; LEVEL: 1; N: 1; NBV: 1; NR: 1; NS: 1; PHP: 1; RS: 0; TCV: 0; TLEV: 0; TLEVC: 0; TM1: 0; TM2: 0; TPB: 0; TPHP: 0; TRS: 0; TRS2: 0; TT: 0; TTT1: 0; TTT2: 0; VJ: 1; XTITUN: 3; IS: 1e-14
R68-R82 = Resistor: TC1: 0; SimulationGenericComponent: True; TC2: 0
U13 = OPA4991IDR: 40-V, DUAL 4.5MHZ, RAIL-TO-RAIL

## Sheet Log and Anti-Log.SchDoc
size Letter; SheetNumber: 7; SheetTotal: 14
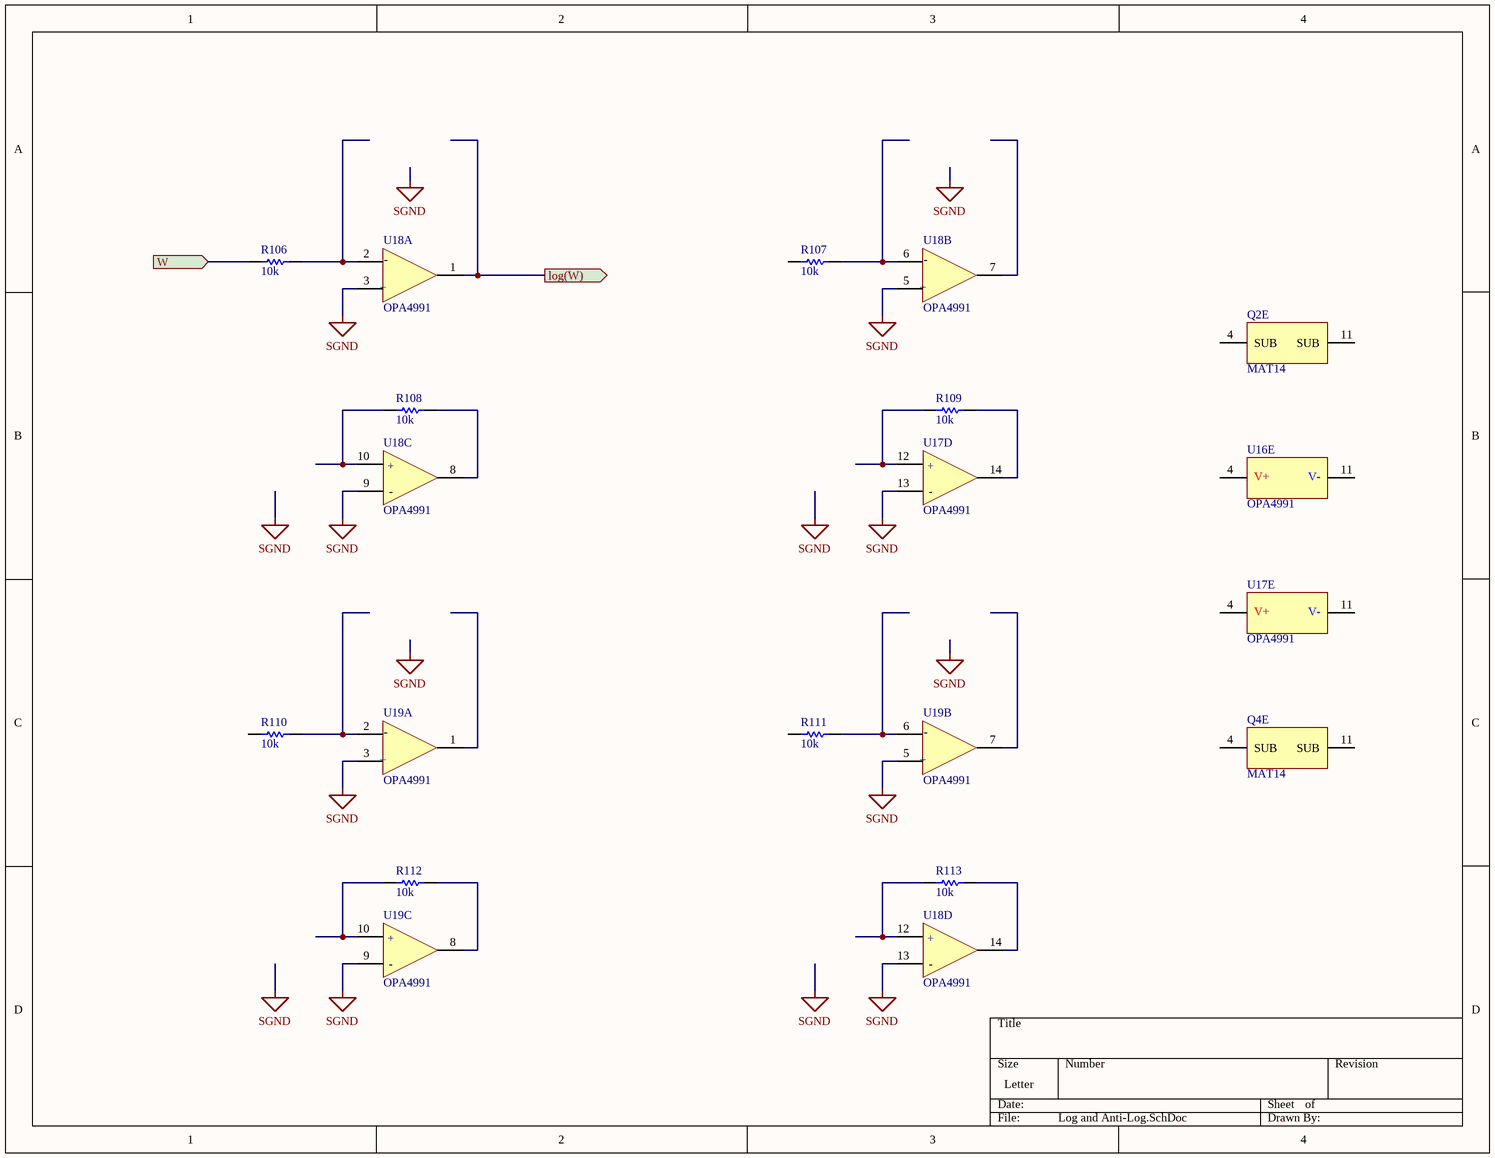
[diagram p7: Log and Anti-Log.SchDoc]

### Parts
Q2  MAT14  [FP-R-14-IPC_B]  (part E of 5)
Q4  MAT14  [FP-R-14-IPC_B]  (part E of 5)
R106  value 10k  (hidden comment: Resistor)
R107  value 10k  (hidden comment: Resistor)
R108  value 10k  (hidden comment: Resistor)
R109  value 10k  (hidden comment: Resistor)
R110  value 10k  (hidden comment: Resistor)
R111  value 10k  (hidden comment: Resistor)
R112  value 10k  (hidden comment: Resistor)
R113  value 10k  (hidden comment: Resistor)
U16  OPA4991  [FP-D0014A-IPC_B]  (part E of 5)
U17  OPA4991  [FP-D0014A-IPC_B]  (parts D,E of 5)
U18  OPA4991  [FP-D0014A-IPC_B]  (parts A,B,C,D of 5)
U19  OPA4991  [FP-D0014A-IPC_B]  (parts A,B,C of 5)

### Ports
log(W) (out), W (in)

### Nets
SGND: U17.13(IN4-) U18.3(IN1+) U18.5(IN2+) U18.9(IN3-) U18.13(IN4-) U19.3(IN1+) U19.5(IN2+) U19.9(IN3-)
NetR106_1: R106.1 ; port W
NetR106_2: R106.2 U18.2(IN1-)
NetR107_2: R107.2 U18.6(IN2-)
NetR108_1: R108.1 U18.10(IN3+)
NetR108_2: R108.2 U18.8(OUT3)
NetR109_1: R109.1 U17.12(IN4+)
NetR109_2: R109.2 U17.14(OUT4)
NetR110_2: R110.2 U19.2(IN1-)
NetR111_2: R111.2 U19.6(IN2-)
NetR112_1: R112.1 U19.10(IN3+)
NetR112_2: R112.2 U19.8(OUT3)
NetR113_1: R113.1 U18.12(IN4+)
NetR113_2: R113.2 U18.14(OUT4)
NetU18_1: U18.1(OUT1) ; port log(W)

Not connected (* = marked no-connect by the designer): Q2 4(SUB) 11(SUB); Q4 4(SUB) 11(SUB); R107 1; R110 1; R111 1; U16 4(V+) 11(V-); U17 4(V+) 11(V-); U18 7(OUT2); U19 1(OUT1) 7(OUT2)

### Notes on the sheet
- (in symbol OPA4991IDR, part A) -; +
- (in symbol OPA4991IDR, part B) -; +
- (in symbol OPA4991IDR, part C) +; -
- (in symbol OPA4991IDR, part D) +; -

### Library data of the parts
Q2 Q4 = MAT14ARZ: TRANS 4NPN 40V 0.03A 14SO; Transition Frequency: 300MHz; Max Collector Current: 30mA; Max Frequency: 1kHz; Collector-emitter Voltage-Max: 60mV; Number of Elements: 4; Polarity: NPN; Max Operating Temperature: 85°C; Collector Emitter Voltage (VCEO): 40V; Collector Emitter Breakdown Voltage: 40V; REACH SVHC: No SVHC; Series: MAT14; Collector Base Voltage (VCBO): 40V; Mount: Surface Mount; Packaging: Rail/Tube; Package Quantity: 56; Case/Package: SOIC; Min Operating Temperature: -40°C; Length: 8.75mm; RoHS Compliant: Yes; Frequency: 300MHz; Radiation Hardening: No; Lead Free: Contains Lead; Collector Emitter Saturation Voltage: 60mV; Height: 1.5mm; Width: 4mm; Number of Pins: 14
R106-R113 = Resistor: TC1: 0; SimulationGenericComponent: True; TC2: 0
U16-U19 = OPA4991IDR: 40-V, DUAL 4.5MHZ, RAIL-TO-RAIL

## Sheet Level Detector.SchDoc
size Letter; SheetNumber: 11; SheetTotal: 14; SPICEModelCacheKLHXWUBC: <root> / <DocumentId>KLHXWUBC</DocumentId> / <CacheFrame Number="0"> / <Model Name="4305rms" Kind="CKT"> / <Text>* / * / *THAT4305 RMS MACROMODEL / *REV 00 6-24-2014 / *CONNECTIONS: / *	        input current / *		|      timing capacitor / *		|      |  output voltage / *		|      |  |       ground / *		|      |  |       |   negative power supply / *		|      |  |       |   |  positive power supply / *		|      |  |       |   |  | / .SUBCKT 4305RMS RMS_IN CT RMS_OUT GND V- V+ / * / Q_Q6         2 1 RMS_IN QPNPRMS / Q_Q10        3 3 4 QPNPRMS / F_F5         CT V- VF_F5 1 / VF_F5        5 V- 0V / F_F3         6 V- VF_F3 1 / VF_F3        2 V- 0V / F_F4         V+ 7 VF_F4 1 / VF_F4        V+ 6 0V / I_I1         8 V- DC 3.2uA / F_F2         V+ 2 VF_F2 1 / VF_F2        V+ 9 0V / Q_Q9         V+ 0 4 QNPNRMS / Q_Q3         9 10 RMS_IN QNPNRMS / E_E1         V+ 10 V+ 11 1 / G_G1         11 0 12 13 6.154e-6 / R_R1         0 11  22Meg / I_I2         14 5 DC 7.5uA / Q_Q1         13 RMS_IN 8 QNPNRMS 1 / R_R4         12 V+  162.5k / R_R3         13 V+  162.5k / C_C1         0 11  4pF / E_E2         10 1 0 3 1 / E_E3         15 16 V+ 14 1 / E_E5         RMS_OUT 15 CT 15 1 / Q_Q2         12 GND 8 QNPNRMS 1 / E_E6         15 0 GND 0 1 / Q_Q4         7 17 18 QNPNRMS 4 / Q_Q7         19 16 18 QPNPRMS 4 / Q_Q5         14 14 V+ QPNPRMS 4 / R_R6         17 7  700 / R_R7         19 16  700 / E_E4         20 15 7 15 1 / Q_Q8         V+ 20 CT QNPNRMS 4 / I_I4         3 V- DC 40nA / I_I5	     V+ V- 370uA / .MODEL QNPNRMS NPN IS=1e-15 BF=200 VAF=800 CJC=.19pF RB=220 / .MODEL QPNPRMS PNP IS=1e-15 BF=75 VAF=80 CJC=.53pF RB=205 / .ENDS</Text> / </Model> / <Model Name="4305vca" Kind="CKT"> / <Text>* / * / *THAT4305 VCA MACROMODEL / *REV 00 6-24-2014 / *CONNECTIONS: / *	        input current / *		|      output current / *		|      |       negative control voltage / *		|      |       |   positive control voltage / *		|      |       |   |   positive power supply / *		|      |       |   |   |  negative power supply / *		|      |       |   |   |  |  ground / *		|      |       |   |   |  |  | / .SUBCKT 4305VCA VCA_IN VCA_OUT EC- EC+ V+ V- GND / * / R_R11        22 20  30 / R_R9         EC+ 34  30 / Q_Q35        20 22 24 QNPNVCA / Q_Q42        30 30 31 QNPNVCA / V_V6         1 2 DC 1.4V / D_D5         1 V+ DNOM / Q_Q43        0 0 31 QPNPVCA / Q_Q33        12 9 10 QNHIB / V_V7         2 3 DC .7V / I_I1         10 V- DC 7.0uA / G_G7         28 V- 40 V- 100e-6 / E_E1         20 28 30 0 2 / Q_Q39        28 28 27 QPNPVCA / Q_Q36        VCA_OUT 34 27 QNPNVCA / R_R36        V- 28  100Meg / Q_Q38        28 28 26 QPNPVCA / I_I9         20 28 DC 130uA / Q_Q41        VCA_OUT EC- 24 QPNPVCA / V_V5         GND 40 DC 1.8V / R_R10        EC- 25  30 / V_Vos        9 GND DC 3mV / D_D6         GND 3 DNOM / C_C3         20 0  4.7pF / R_R12        21 20  30 / G_G5         V+ 2 11 12 33.65e-6 / R_R35        12 V+  15k / R_R34        11 V+  15k / R_R29        GND 2  25Meg / G_G6         V+ 20 2 GND 2.3e-3 / C_C4         GND 2 16pF / Q_Q37        20 21 23 QNPNVCA / I_I8         28 V- DC 950uA / I_I10        V+ 6 DC 100uA / D_D7         6 V- DNOM / I_I11        V+ 7 DC 100uA / D_D8         7 V- DNOM / Q_Q40        VCA_IN EC+ 23 QPNPVCA / Q_Q34        VCA_IN 25 26 QNPNVCA / Q_Q32        11 VCA_IN 10 QNHIB / G_G8         VCA_IN V- 6 7 40e-5 / I_I2         0 30 DC 22uA / I_Isym       0 34 DC 4.4uA / V_V9	     V+ 4 2.8V / R_R40	     4 V- 40k / .model DNOM D Is=1e-14 Cjo=.1pF Rs=.1 / .model QNHIB NPN BF=2000 / .model QNPNVCA NPN IS=5e-16 BF=150 VAF=150 RB=45 CJC=1.0pF / .model QPNPVCA PNP IS=5e-16 BF=75 VAF=100 RB=100 CJC=1.1pF / .ENDS</Text> / </Model> / <Model Name="that4305" Kind="CKT"> / <Text>* / * This information is protected under the United States copyright / * laws. THAT Corporation ("THAT") hereby grants users of this / * macromodel (the "User"), a nonexclusive, nontransferable / * license to use this macromodel as long as the licensee abides / * by the terms of this agreement.  Before using the macromodel, / * the User should read this license.  If the User does not accept / * these terms, the macromodel contained herein should be erased, / * destroyed or returned to THAT within 30 days. / * / * The User may copy and distribute, at no charge, verbatim copies / * of the Macromodel as contained herein, in any medium, provided / * that the User conspicuously publishes on each copy this copyright / * notice and disclaimer of warranty.  The User may modify this / * macromodel to suit his or her specific applications, and the User / * may make copies of the modified macromodel for use within his or / * her company only, and provided the modified files carry prominent / * notices stating that the files have been changed, and the date of / * any changes. / * / * This macromodel is provided "AS IS, WHERE IS, AND WITH NO WARRANTY / * OF ANY KIND EITHER EXPRESSED OR IMPLIED, INCLUDING BUT NOT LIMITED / * TO ANY IMPLIED WARRANTIES OF MERCHANTABILITY AND FITNESS FOR A / * PARTICULAR PURPOSE."  In no event will THAT be liable for special, / * collateral, incidental, or consequential damages in connection / * with or arising out of the use of this macromodel.  THAT reserves / * the right to make changes to the products and macromodel without / * prior notice. / * / *THAT4305 MACROMODEL / *REV 02 6-1-2017 / *All in one subcircuit. replaces VCC and VEE by V+ and V-, respectively: / .SUBCKT THAT4305 RMS_IN CT RMS_OUT GND V- V+ VCA_IN VCA_OUT EC- EC+ / X_X1      RMS_IN CT RMS_OUT GND V- V+ 4305RMS / X_X2      VCA_IN VCA_OUT EC- EC+ V+ V- GND 4305VCA / .ENDS</Text> / <Dependency>0\4305rms</Dependency> / <Dependency>0\4305vca</Dependency> / </Model> / </CacheFrame> / </root>
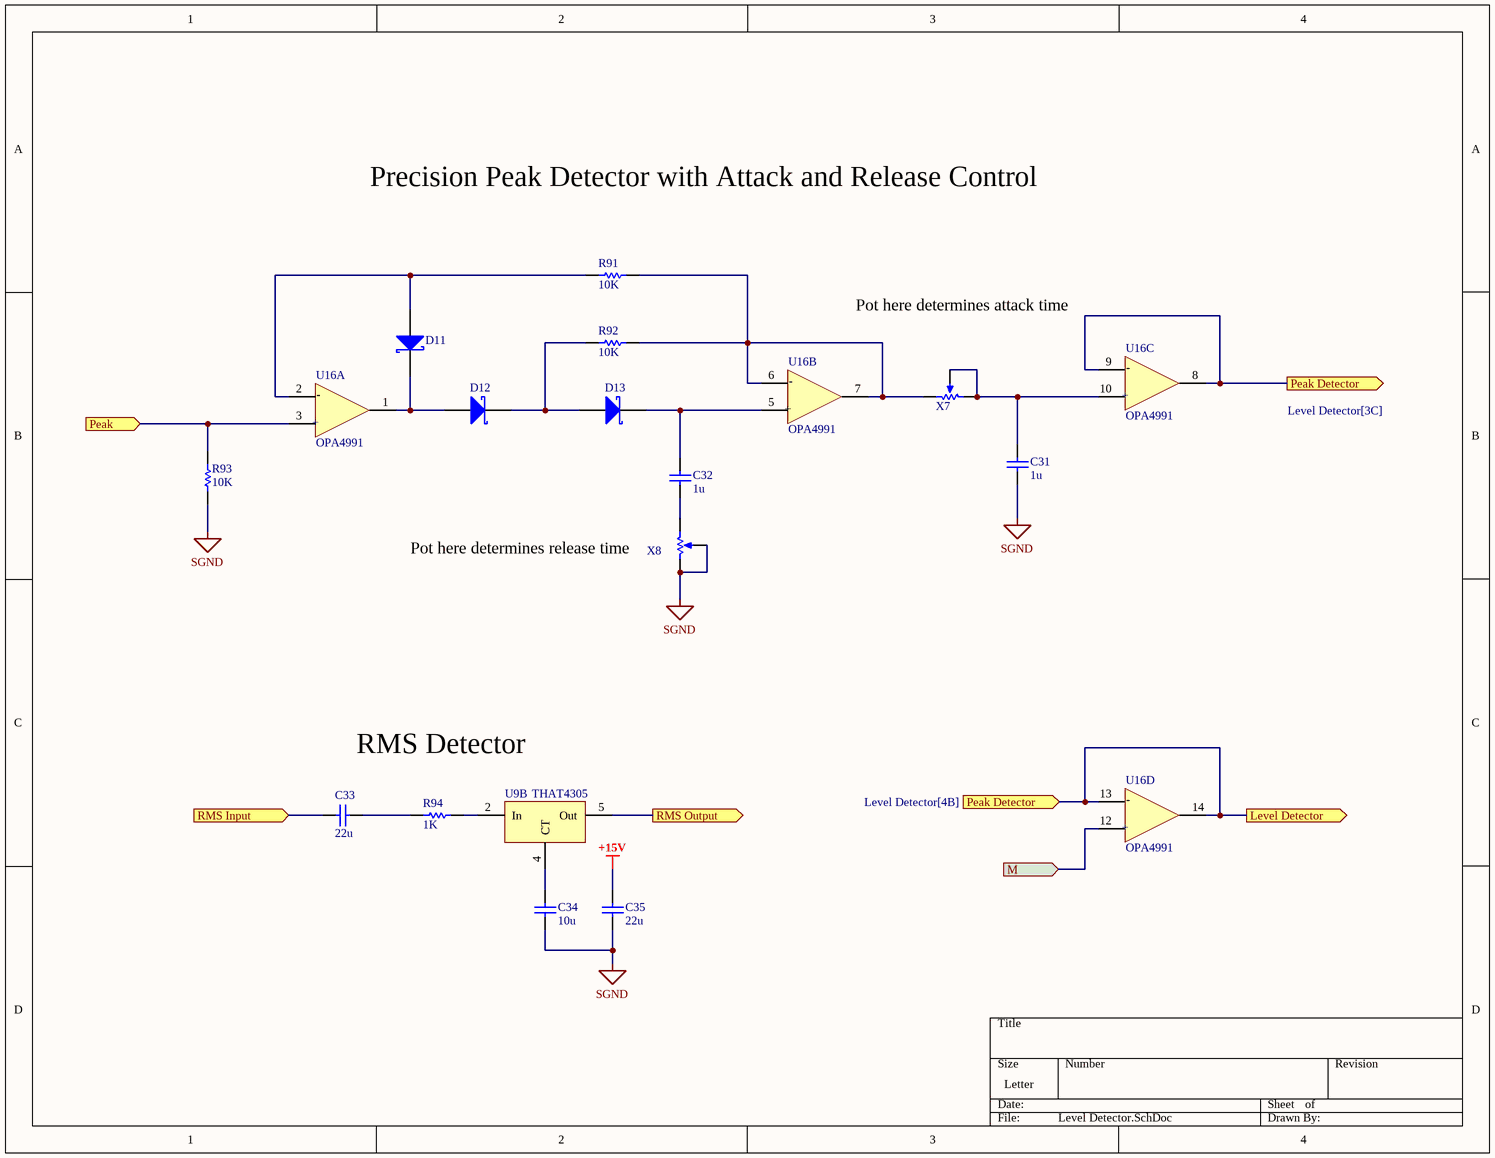
[diagram p8: Level Detector.SchDoc]

### Parts
C31  value 1u  (hidden comment: Capacitor)
C32  value 1u  (hidden comment: Capacitor)
C33  value 22u  (hidden comment: Capacitor)
C34  value 10u  (hidden comment: Capacitor)
C35  value 22u  (hidden comment: Capacitor)
D11  Schottky Diode  (value not drawn)
D12  Schottky Diode  (value not drawn)
D13  Schottky Diode  (value not drawn)
R91  value 10K  (hidden comment: Resistor)
R92  value 10K  (hidden comment: Resistor)
R93  value 10K  (hidden comment: Resistor)
R94  value 1K  (hidden comment: Resistor)
U9  THAT4305  [QSOP-16]  (part B of 2)
U16  OPA4991  [FP-D0014A-IPC_B]  (parts A,B,C,D of 5)
X7  Potentiometer  (value not drawn)
X8  Potentiometer  (value not drawn)

### Ports
Level Detector (out), M (in), Peak (in), Peak Detector (in, see Level Detector[4B]), Peak Detector (out, see Level Detector[3C]), RMS Input (in), RMS Output (out)

### Nets
+15V: C35.2
SGND: C31.1 C34.1 C35.1 R93.1 X8.2(BOT) X8.3(TAP)
NetC31_2: C31.2 U16.10(IN3+) X7.2(BOT) X7.3(TAP)
NetC32_1: C32.1 X8.1(TOP)
NetC32_2: C32.2 D13.2(K) U16.5(IN2+)
NetC33_1: C33.1 R94.1
NetC33_2: C33.2 ; port RMS Input
NetC34_2: C34.2 U9.4(CT)
NetD11_1: D11.1(A) R91.2 U16.2(IN1-)
NetD11_2: D11.2(K) D12.1(A) U16.1(OUT1)
NetD12_2: D12.2(K) D13.1(A) R92.2
NetR91_1: R91.1 R92.1 U16.6(IN2-) U16.7(OUT2) X7.1(TOP)
NetR93_2: R93.2 U16.3(IN1+) ; port Peak
NetR94_2: R94.2 U9.2(In)
NetU9_5: U9.5(Out) ; port RMS Output
NetU16_8: U16.8(OUT3) U16.9(IN3-) U16.13(IN4-) U16.14(OUT4) ; port Peak Detector, port Level Detector
NetU16_12: U16.12(IN4+) ; port M

### Notes on the sheet
- Precision Peak Detector with Attack and Release Control
- Pot here determines attack time
- (near X8) Pot here determines release time
- RMS Detector
- (in symbol OPA4991IDR, part A) -; +
- (in symbol OPA4991IDR, part B) -; +
- (in symbol OPA4991IDR, part C) -; +
- (in symbol OPA4991IDR, part D) -; +

### Library data of the parts
C31-C35 = Capacitor: SimulationGenericComponent: True
D11-D13 = Schottky Diode: AF: 1; BV: 0; BV_MAX: 1e99; EG: 1.11; FC: 0.5; IBV: 0.001; IS: 1e-14; MJSW: 0.33; NTUN: 30; TNOM: 27; XTI: 3; SimulationGenericComponent: True; CJO: 0; CJP: 0; CTA: 0; CTP: 0; FCS: 0.5; FV_MAX: 1e99; IKF: 0; IKR: 0; ISR: 1e-14; JSW: 0; JTUN: 0; JTUNSW: 0; KEG: 1; KF: 0; LEVEL: 1; N: 1; NBV: 1; NR: 1; NS: 1; PHP: 1; RS: 0; TCV: 0; TLEV: 0; TLEVC: 0; TM1: 0; TM2: 0; TPB: 0; TPHP: 0; TRS: 0; TRS2: 0; TT: 0; TTT1: 0; TTT2: 0; VJ: 1; XTITUN: 3
R91-R94 = Resistor: TC1: 0; SimulationGenericComponent: True; TC2: 0
U9 = 4305Q16-U: Pre-trimmed Analog Engine® Dynamics Processor IC
U16 = OPA4991IDR: 40-V, DUAL 4.5MHZ, RAIL-TO-RAIL
X7 X8 = Potentiometer: as X2 on sheet Precision FBR & dB Converter

## Sheet Gain Control.SchDoc
size Letter; SheetNumber: 12; SheetTotal: 14; SPICEModelCacheHADLSIVX: <root> / <DocumentId>HADLSIVX</DocumentId> / <CacheFrame Number="0"> / <Model Name="4305rms" Kind="CKT"> / <Text>* / * / *THAT4305 RMS MACROMODEL / *REV 00 6-24-2014 / *CONNECTIONS: / *	        input current / *		|      timing capacitor / *		|      |  output voltage / *		|      |  |       ground / *		|      |  |       |   negative power supply / *		|      |  |       |   |  positive power supply / *		|      |  |       |   |  | / .SUBCKT 4305RMS RMS_IN CT RMS_OUT GND V- V+ / * / Q_Q6         2 1 RMS_IN QPNPRMS / Q_Q10        3 3 4 QPNPRMS / F_F5         CT V- VF_F5 1 / VF_F5        5 V- 0V / F_F3         6 V- VF_F3 1 / VF_F3        2 V- 0V / F_F4         V+ 7 VF_F4 1 / VF_F4        V+ 6 0V / I_I1         8 V- DC 3.2uA / F_F2         V+ 2 VF_F2 1 / VF_F2        V+ 9 0V / Q_Q9         V+ 0 4 QNPNRMS / Q_Q3         9 10 RMS_IN QNPNRMS / E_E1         V+ 10 V+ 11 1 / G_G1         11 0 12 13 6.154e-6 / R_R1         0 11  22Meg / I_I2         14 5 DC 7.5uA / Q_Q1         13 RMS_IN 8 QNPNRMS 1 / R_R4         12 V+  162.5k / R_R3         13 V+  162.5k / C_C1         0 11  4pF / E_E2         10 1 0 3 1 / E_E3         15 16 V+ 14 1 / E_E5         RMS_OUT 15 CT 15 1 / Q_Q2         12 GND 8 QNPNRMS 1 / E_E6         15 0 GND 0 1 / Q_Q4         7 17 18 QNPNRMS 4 / Q_Q7         19 16 18 QPNPRMS 4 / Q_Q5         14 14 V+ QPNPRMS 4 / R_R6         17 7  700 / R_R7         19 16  700 / E_E4         20 15 7 15 1 / Q_Q8         V+ 20 CT QNPNRMS 4 / I_I4         3 V- DC 40nA / I_I5	     V+ V- 370uA / .MODEL QNPNRMS NPN IS=1e-15 BF=200 VAF=800 CJC=.19pF RB=220 / .MODEL QPNPRMS PNP IS=1e-15 BF=75 VAF=80 CJC=.53pF RB=205 / .ENDS</Text> / </Model> / <Model Name="4305vca" Kind="CKT"> / <Text>* / * / *THAT4305 VCA MACROMODEL / *REV 00 6-24-2014 / *CONNECTIONS: / *	        input current / *		|      output current / *		|      |       negative control voltage / *		|      |       |   positive control voltage / *		|      |       |   |   positive power supply / *		|      |       |   |   |  negative power supply / *		|      |       |   |   |  |  ground / *		|      |       |   |   |  |  | / .SUBCKT 4305VCA VCA_IN VCA_OUT EC- EC+ V+ V- GND / * / R_R11        22 20  30 / R_R9         EC+ 34  30 / Q_Q35        20 22 24 QNPNVCA / Q_Q42        30 30 31 QNPNVCA / V_V6         1 2 DC 1.4V / D_D5         1 V+ DNOM / Q_Q43        0 0 31 QPNPVCA / Q_Q33        12 9 10 QNHIB / V_V7         2 3 DC .7V / I_I1         10 V- DC 7.0uA / G_G7         28 V- 40 V- 100e-6 / E_E1         20 28 30 0 2 / Q_Q39        28 28 27 QPNPVCA / Q_Q36        VCA_OUT 34 27 QNPNVCA / R_R36        V- 28  100Meg / Q_Q38        28 28 26 QPNPVCA / I_I9         20 28 DC 130uA / Q_Q41        VCA_OUT EC- 24 QPNPVCA / V_V5         GND 40 DC 1.8V / R_R10        EC- 25  30 / V_Vos        9 GND DC 3mV / D_D6         GND 3 DNOM / C_C3         20 0  4.7pF / R_R12        21 20  30 / G_G5         V+ 2 11 12 33.65e-6 / R_R35        12 V+  15k / R_R34        11 V+  15k / R_R29        GND 2  25Meg / G_G6         V+ 20 2 GND 2.3e-3 / C_C4         GND 2 16pF / Q_Q37        20 21 23 QNPNVCA / I_I8         28 V- DC 950uA / I_I10        V+ 6 DC 100uA / D_D7         6 V- DNOM / I_I11        V+ 7 DC 100uA / D_D8         7 V- DNOM / Q_Q40        VCA_IN EC+ 23 QPNPVCA / Q_Q34        VCA_IN 25 26 QNPNVCA / Q_Q32        11 VCA_IN 10 QNHIB / G_G8         VCA_IN V- 6 7 40e-5 / I_I2         0 30 DC 22uA / I_Isym       0 34 DC 4.4uA / V_V9	     V+ 4 2.8V / R_R40	     4 V- 40k / .model DNOM D Is=1e-14 Cjo=.1pF Rs=.1 / .model QNHIB NPN BF=2000 / .model QNPNVCA NPN IS=5e-16 BF=150 VAF=150 RB=45 CJC=1.0pF / .model QPNPVCA PNP IS=5e-16 BF=75 VAF=100 RB=100 CJC=1.1pF / .ENDS</Text> / </Model> / <Model Name="that4305" Kind="CKT"> / <Text>* / * This information is protected under the United States copyright / * laws. THAT Corporation ("THAT") hereby grants users of this / * macromodel (the "User"), a nonexclusive, nontransferable / * license to use this macromodel as long as the licensee abides / * by the terms of this agreement.  Before using the macromodel, / * the User should read this license.  If the User does not accept / * these terms, the macromodel contained herein should be erased, / * destroyed or returned to THAT within 30 days. / * / * The User may copy and distribute, at no charge, verbatim copies / * of the Macromodel as contained herein, in any medium, provided / * that the User conspicuously publishes on each copy this copyright / * notice and disclaimer of warranty.  The User may modify this / * macromodel to suit his or her specific applications, and the User / * may make copies of the modified macromodel for use within his or / * her company only, and provided the modified files carry prominent / * notices stating that the files have been changed, and the date of / * any changes. / * / * This macromodel is provided "AS IS, WHERE IS, AND WITH NO WARRANTY / * OF ANY KIND EITHER EXPRESSED OR IMPLIED, INCLUDING BUT NOT LIMITED / * TO ANY IMPLIED WARRANTIES OF MERCHANTABILITY AND FITNESS FOR A / * PARTICULAR PURPOSE."  In no event will THAT be liable for special, / * collateral, incidental, or consequential damages in connection / * with or arising out of the use of this macromodel.  THAT reserves / * the right to make changes to the products and macromodel without / * prior notice. / * / *THAT4305 MACROMODEL / *REV 02 6-1-2017 / *All in one subcircuit. replaces VCC and VEE by V+ and V-, respectively: / .SUBCKT THAT4305 RMS_IN CT RMS_OUT GND V- V+ VCA_IN VCA_OUT EC- EC+ / X_X1      RMS_IN CT RMS_OUT GND V- V+ 4305RMS / X_X2      VCA_IN VCA_OUT EC- EC+ V+ V- GND 4305VCA / .ENDS</Text> / <Dependency>0\4305rms</Dependency> / <Dependency>0\4305vca</Dependency> / </Model> / </CacheFrame> / </root>
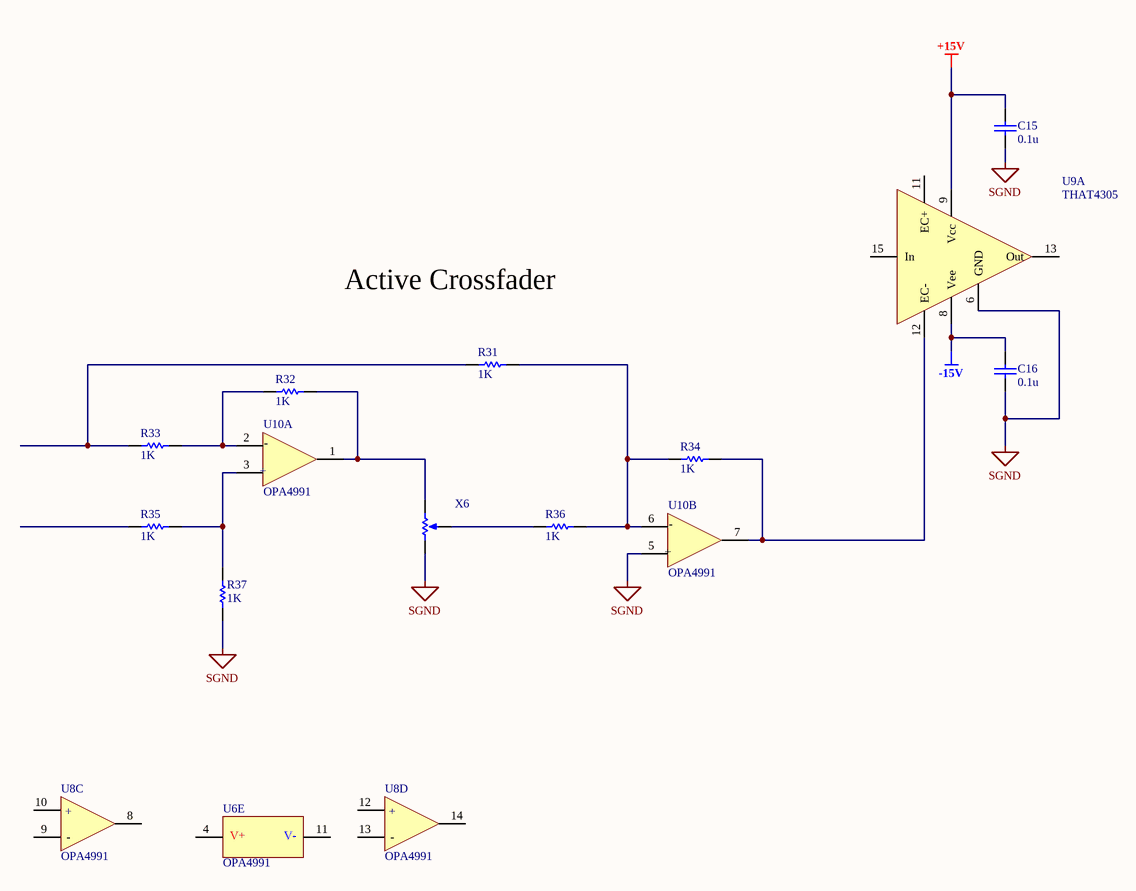
[diagram p9: Gain Control.SchDoc]

### Parts
(Parts that share a designator on the sheet are numbered #1, #2 ... from top to bottom, then left to right.)
C15  value 0.1u  (hidden comment: Capacitor)
C16  value 0.1u  (hidden comment: Capacitor)
R31  value 1K  (hidden comment: Resistor)
R32  value 1K  (hidden comment: Resistor)
R33  value 1K  (hidden comment: Resistor)
R34  value 1K  (hidden comment: Resistor)
R35  value 1K  (hidden comment: Resistor)
R36  value 1K  (hidden comment: Resistor)
R37  value 1K  (hidden comment: Resistor)
U6  OPA4991  [FP-D0014A-IPC_B]  (part E of 5)
U8#2  OPA4991  [FP-D0014A-IPC_B]  (parts C,D of 5)
U9  THAT4305  [QSOP-16]  (part A of 2)
U10  OPA4991  [FP-D0014A-IPC_B]  (parts A,B of 5)
X6  Potentiometer  (value not drawn)

### Nets
+15V: C15.2 U9.9(Vcc)
-15V: C16.2 U9.8(Vee)
SGND: C15.1 C16.1 R37.1 U9.6(GND) U10.5(IN2+) X6.1(TOP)
NetR31_1: R31.1 R33.1
NetR31_2: R31.2 R34.1 R36.2 U10.6(IN2-)
NetR32_1: R32.1 R33.2 U10.2(IN1-)
NetR32_2: R32.2 U10.1(OUT1) X6.2(BOT)
NetR34_2: R34.2 U9.12(EC-) U10.7(OUT2)
NetR35_2: R35.2 R37.2 U10.3(IN1+)
NetR36_1: R36.1 X6.3(TAP)

Not connected (* = marked no-connect by the designer): R35 1; U6 4(V+) 11(V-); U8#2 8(OUT3) 9(IN3-) 10(IN3+) 12(IN4+) 13(IN4-) 14(OUT4); U9 11(EC+) 13(Out) 15(In)

### Notes on the sheet
- Active Crossfader
- (in symbol OPA4991IDR, part A) -; +
- (in symbol OPA4991IDR, part B) -; +
- (in symbol OPA4991IDR, part C) +; -
- (in symbol OPA4991IDR, part D) +; -

### Library data of the parts
C15 C16 = Capacitor: SimulationGenericComponent: True
R31-R37 = Resistor: TC1: 0; SimulationGenericComponent: True; TC2: 0
U6 U8#2 U10 = OPA4991IDR: 40-V, DUAL 4.5MHZ, RAIL-TO-RAIL
U9 = 4305Q16-U: as U9 on sheet Level Detector
X6 = Potentiometer: as X2 on sheet Precision FBR & dB Converter

## Sheet VCA.SchDoc
size Letter; SheetNumber: 10; SheetTotal: 14
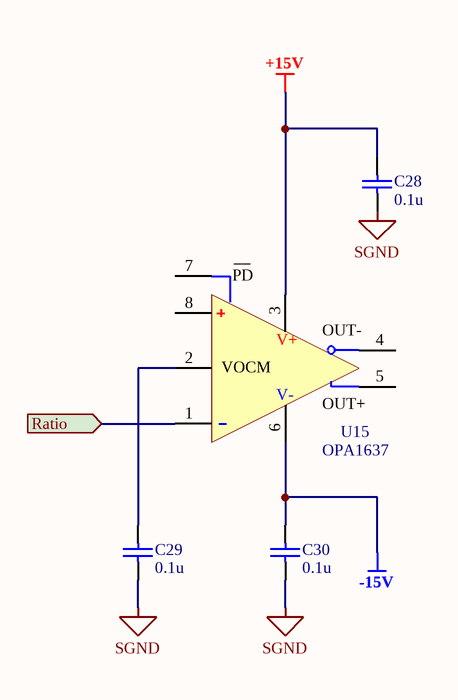
[diagram p10: VCA.SchDoc]

### Parts
C28  value 0.1u  (hidden comment: Capacitor)
C29  value 0.1u  (hidden comment: Capacitor)
C30  value 0.1u  (hidden comment: Capacitor)
U15  OPA1637  [FP-DGK0008A-IPC_A]

### Ports
Ratio (in)

### Nets
+15V: C28.2 U15.3(VS+)
-15V: C30.2 U15.6(VS-)
SGND: C28.1 C29.1 C30.1
NetC29_2: C29.2 U15.2(VOCM)
NetU15_1: U15.1(IN-) ; port Ratio

Not connected (* = marked no-connect by the designer): U15 4(OUT+) 5(OUT-) 7(~{PD}) 8(IN+)

### Notes on the sheet
- (in symbol OPA1637DGKT) __; PD; V+; V-

### Library data of the parts
C28-C30 = Capacitor: SimulationGenericComponent: True
U15 = OPA1637DGKT: Fully differential amplifier